# EAGLE board haasoscope_pro_adc_board - no blind (EAGLE 9.6.2), part 1 of 2
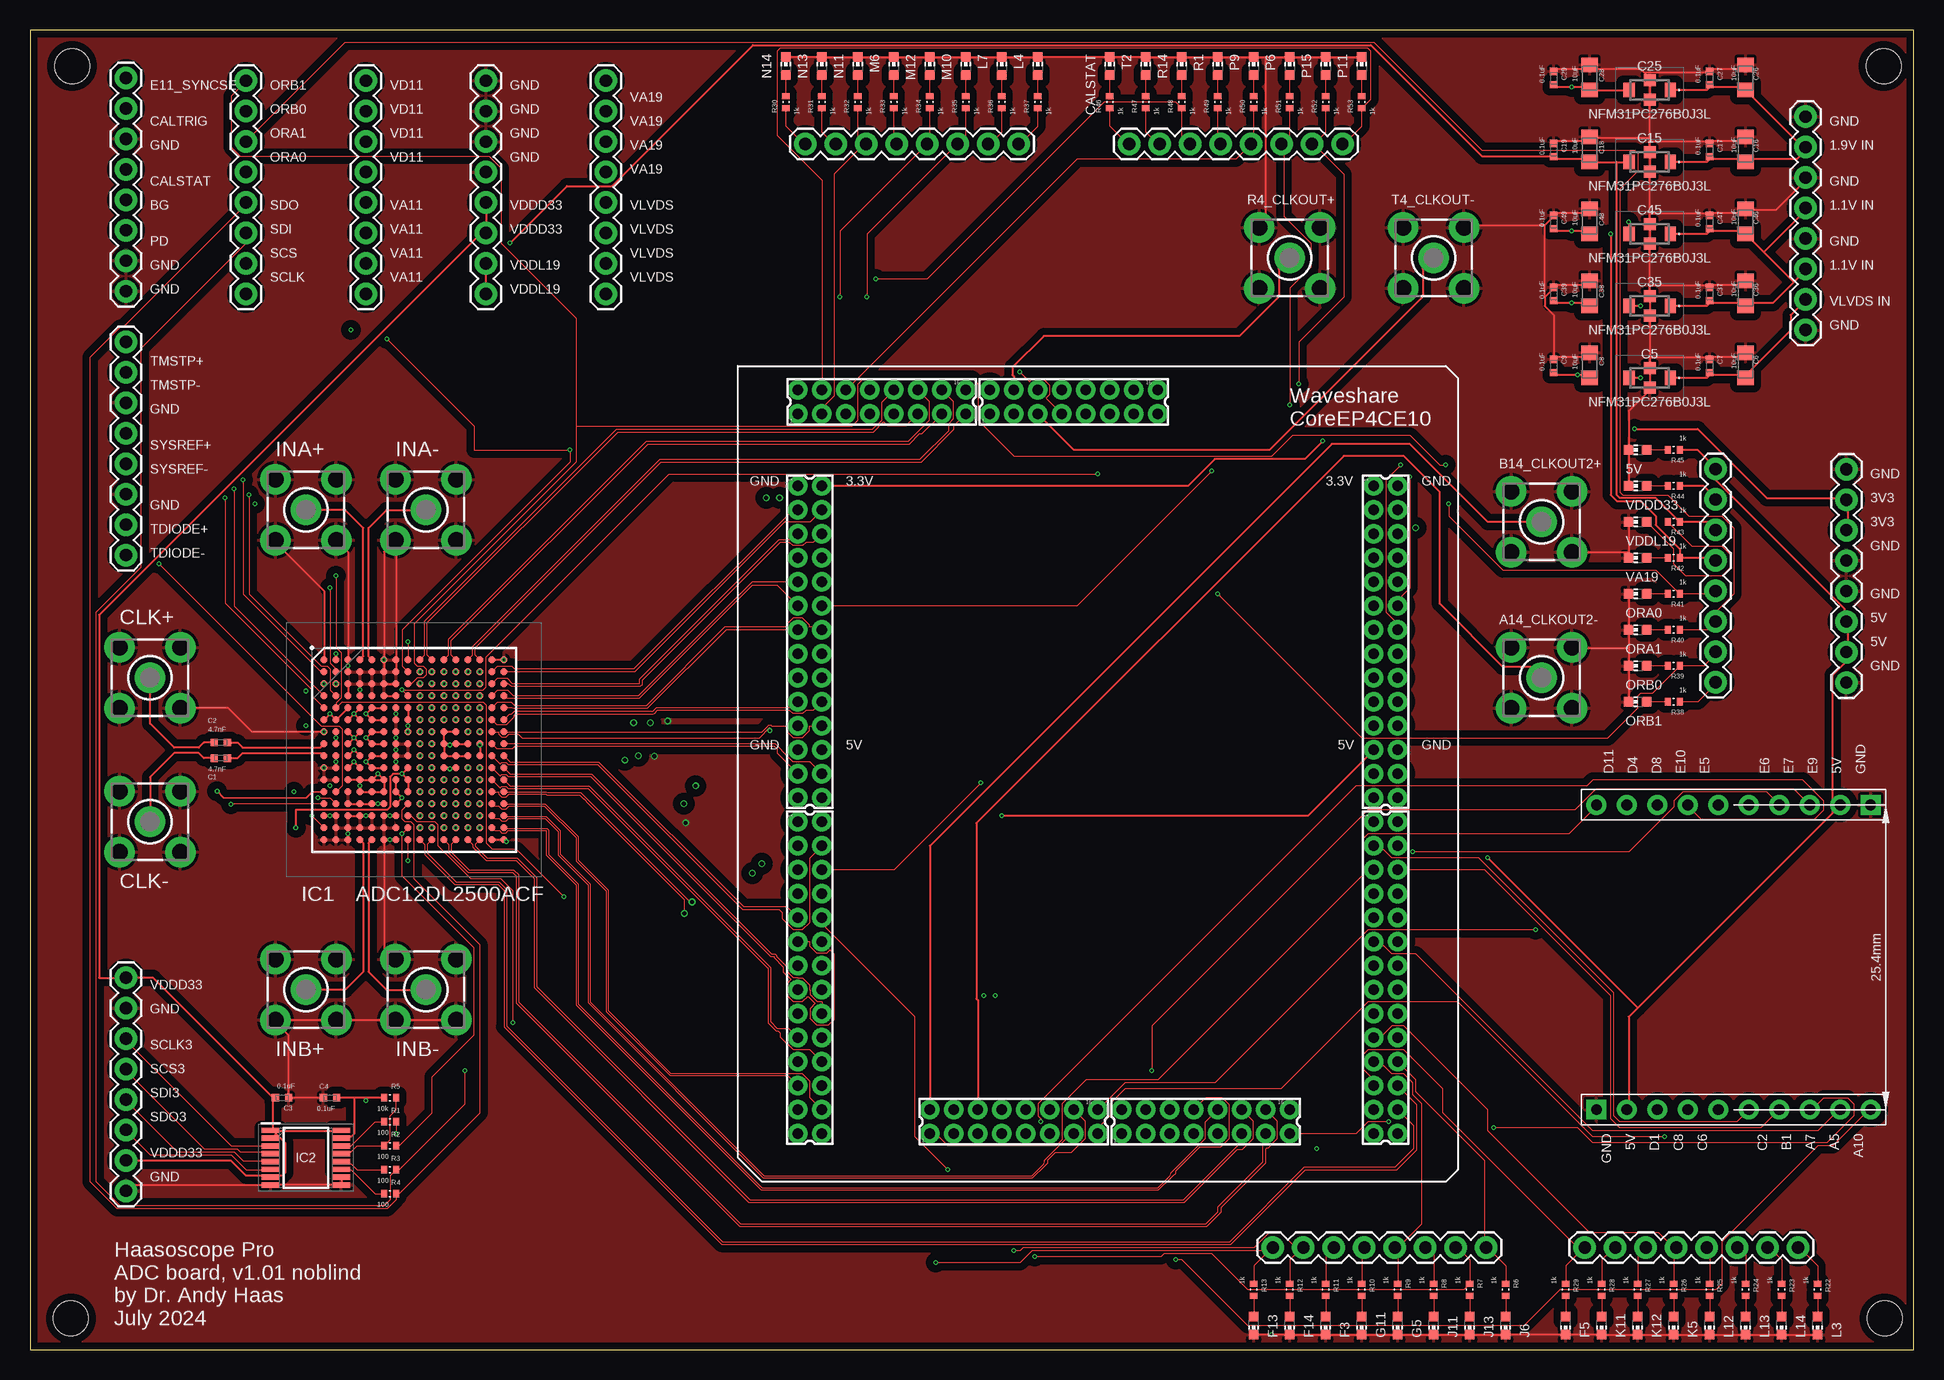
[diagram p3: board, top side]
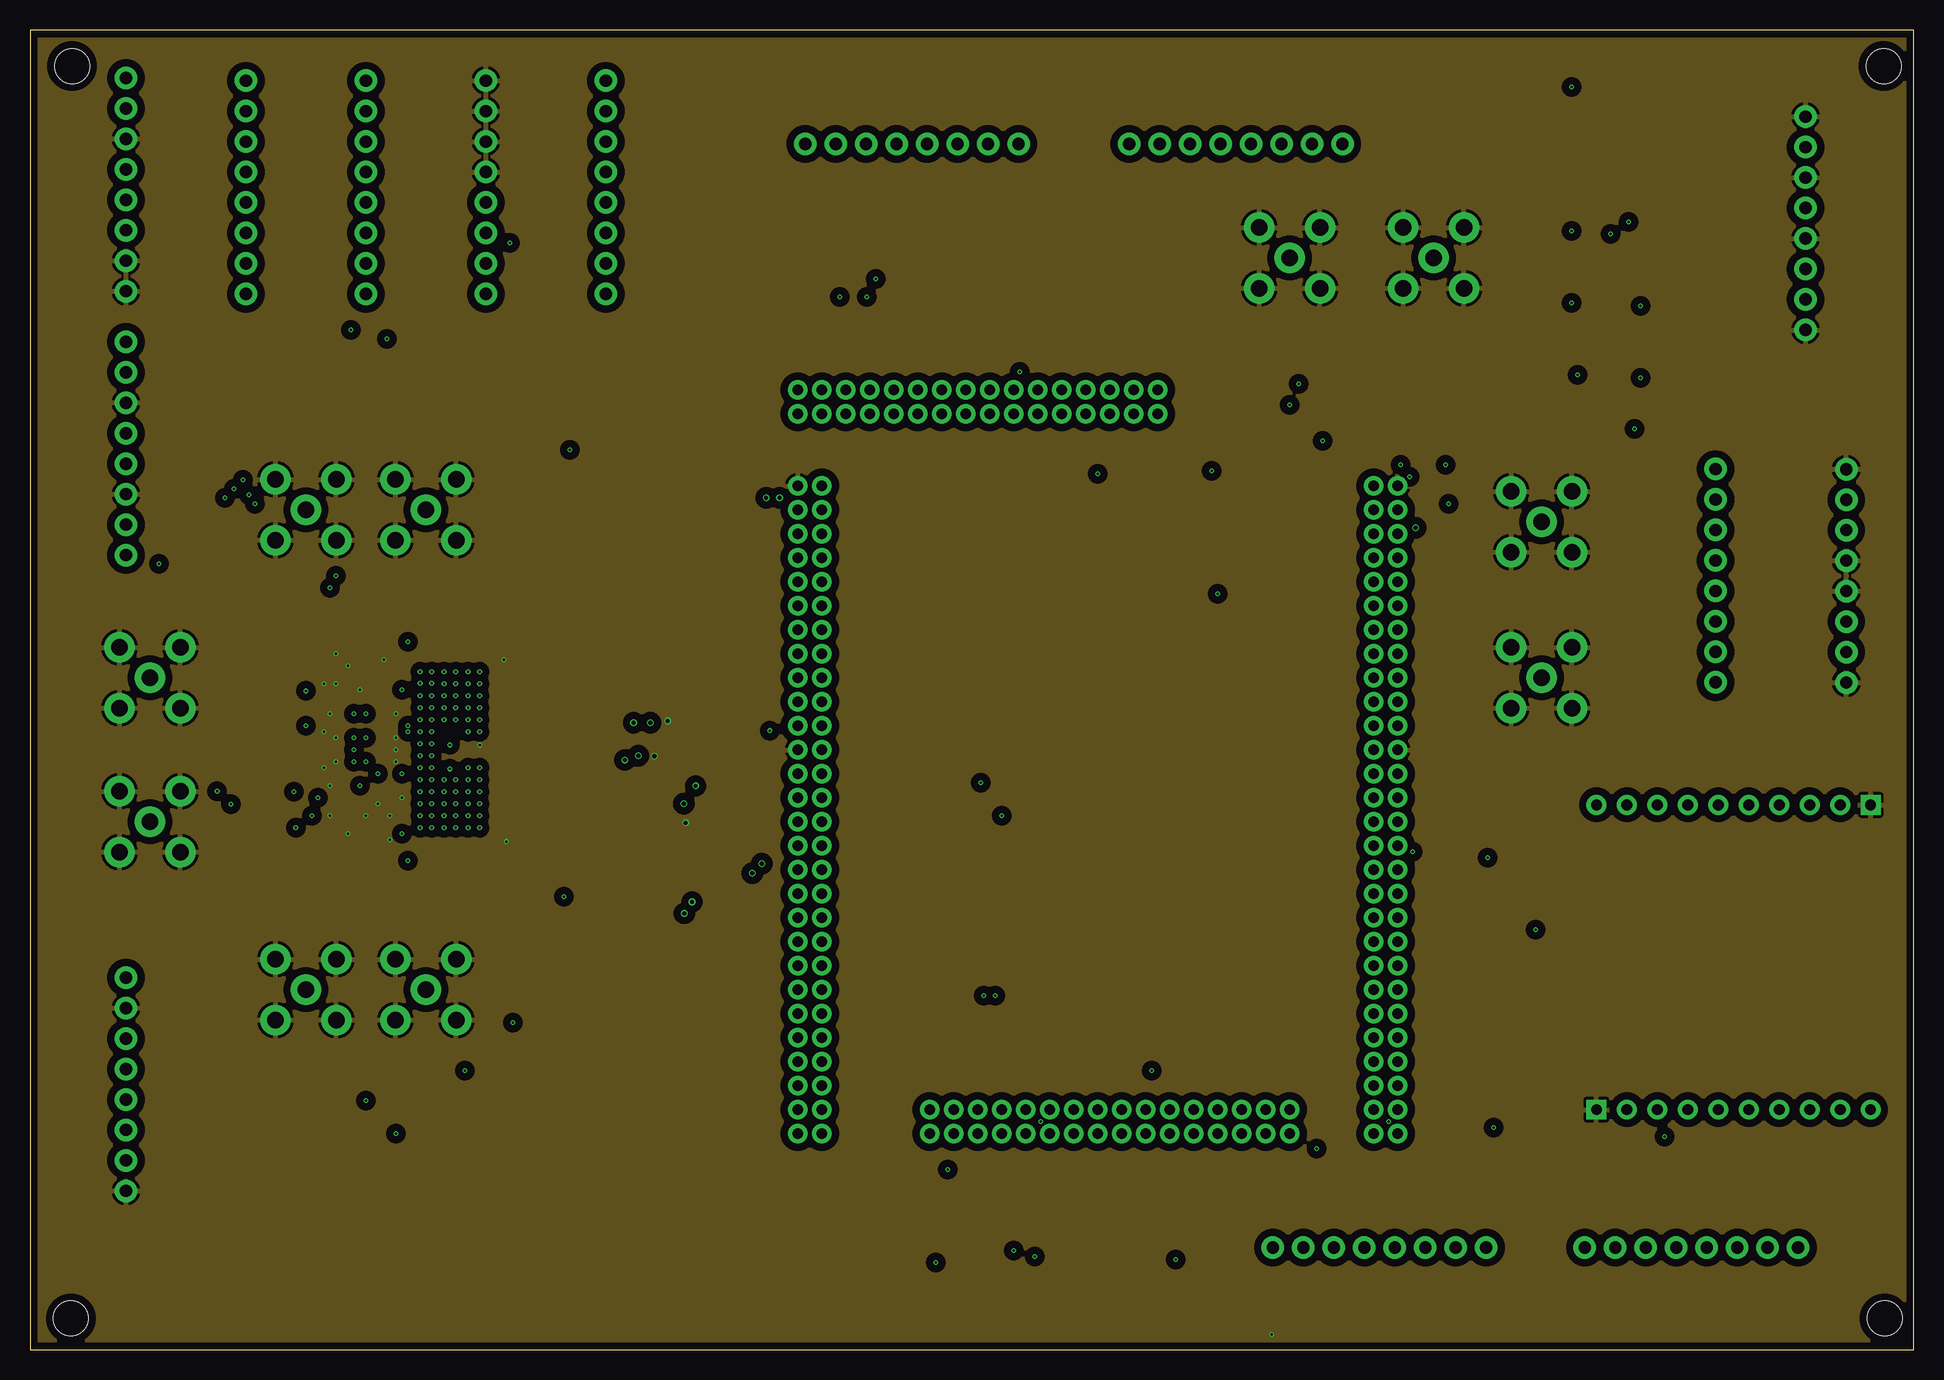
[diagram p4: board, inner layer topgnd]
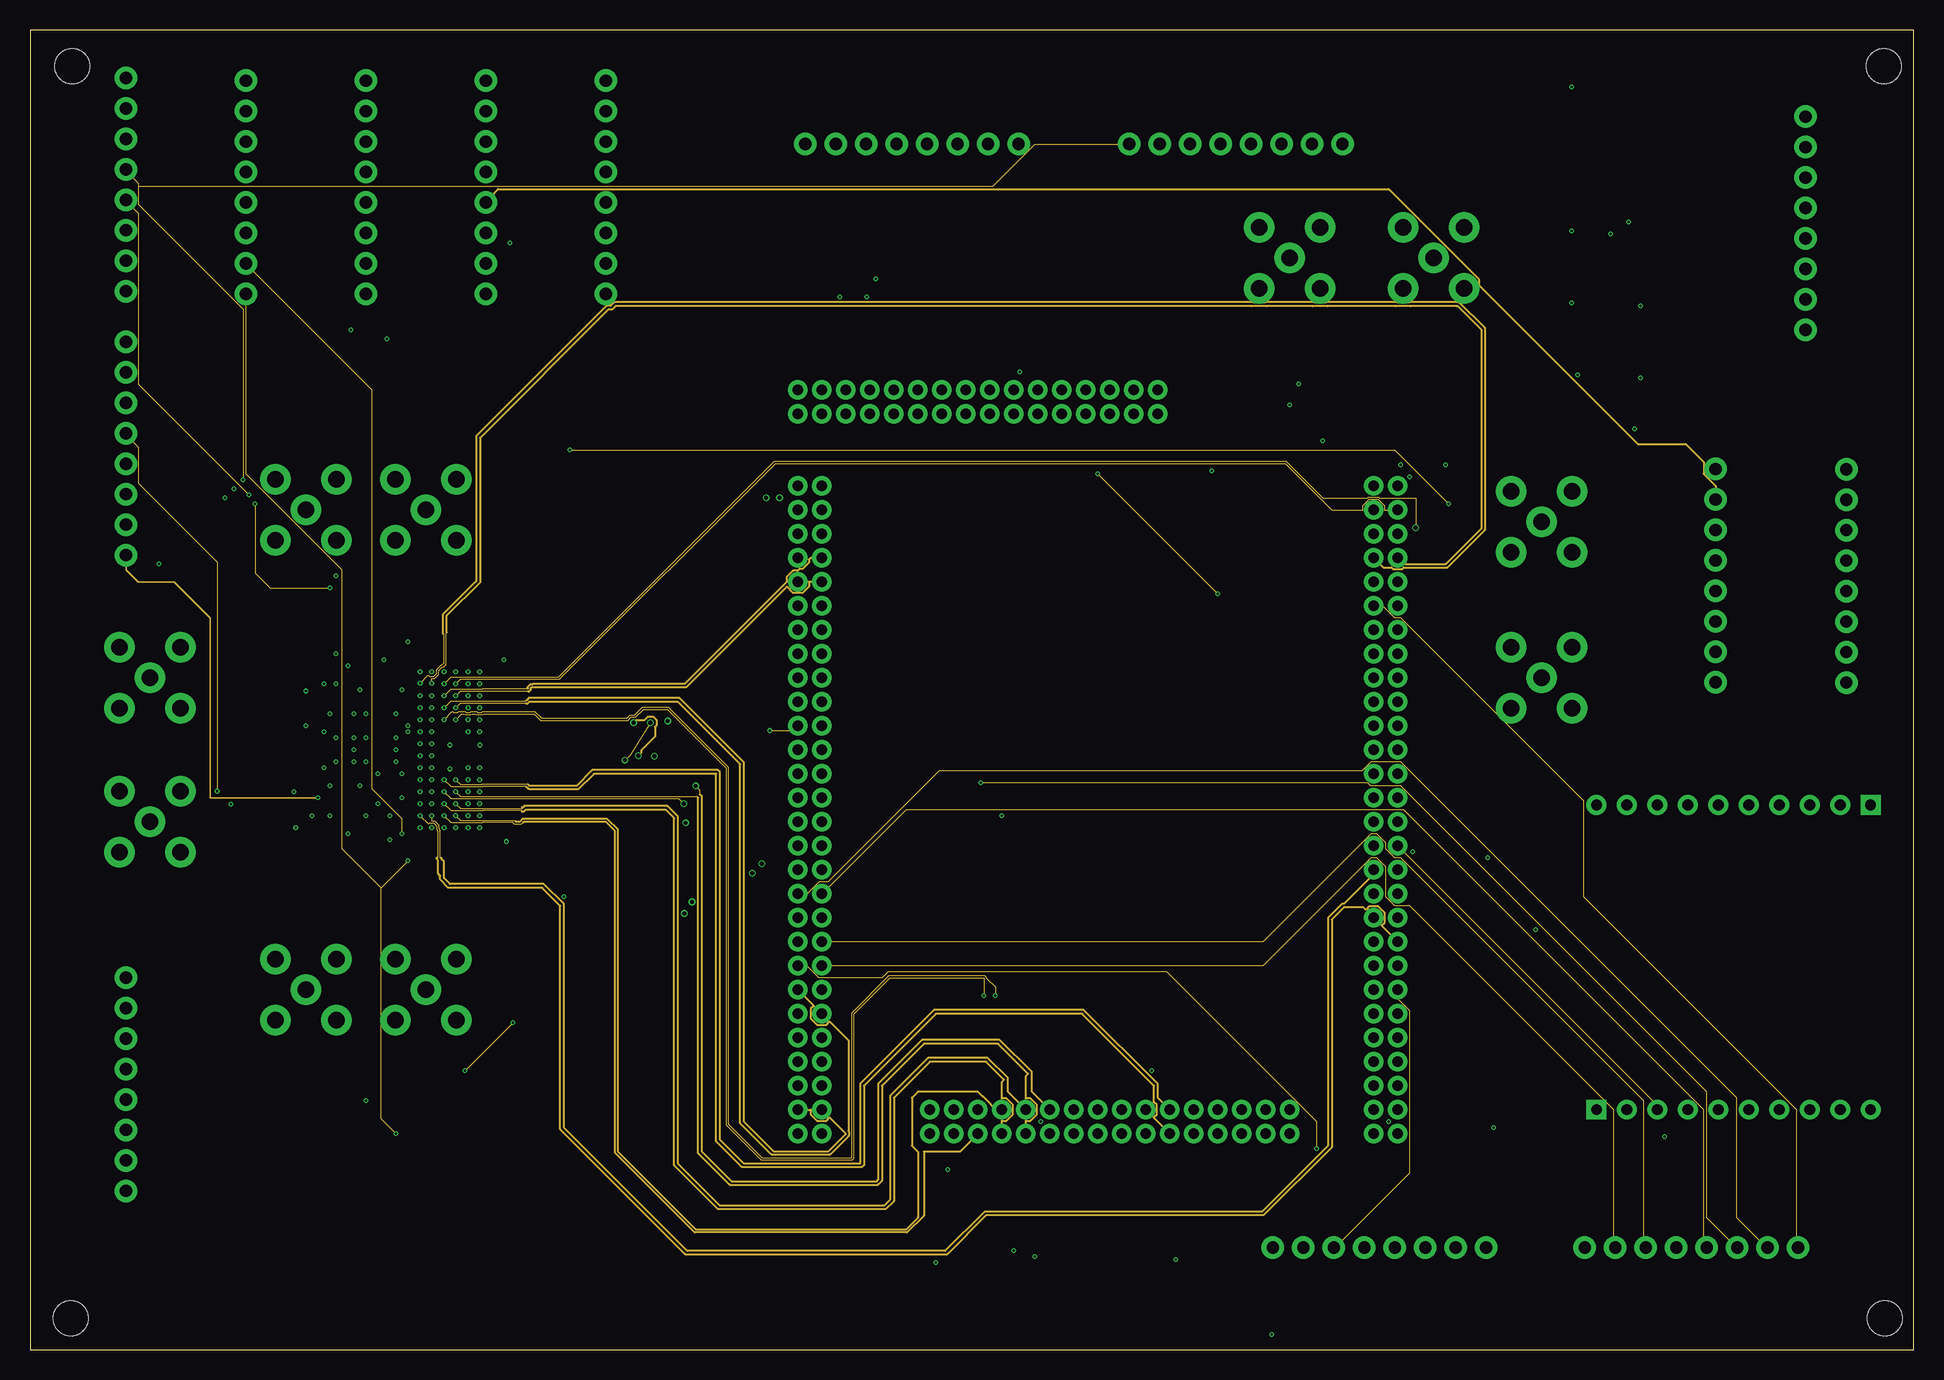
[diagram p5: board, inner layer sig2]
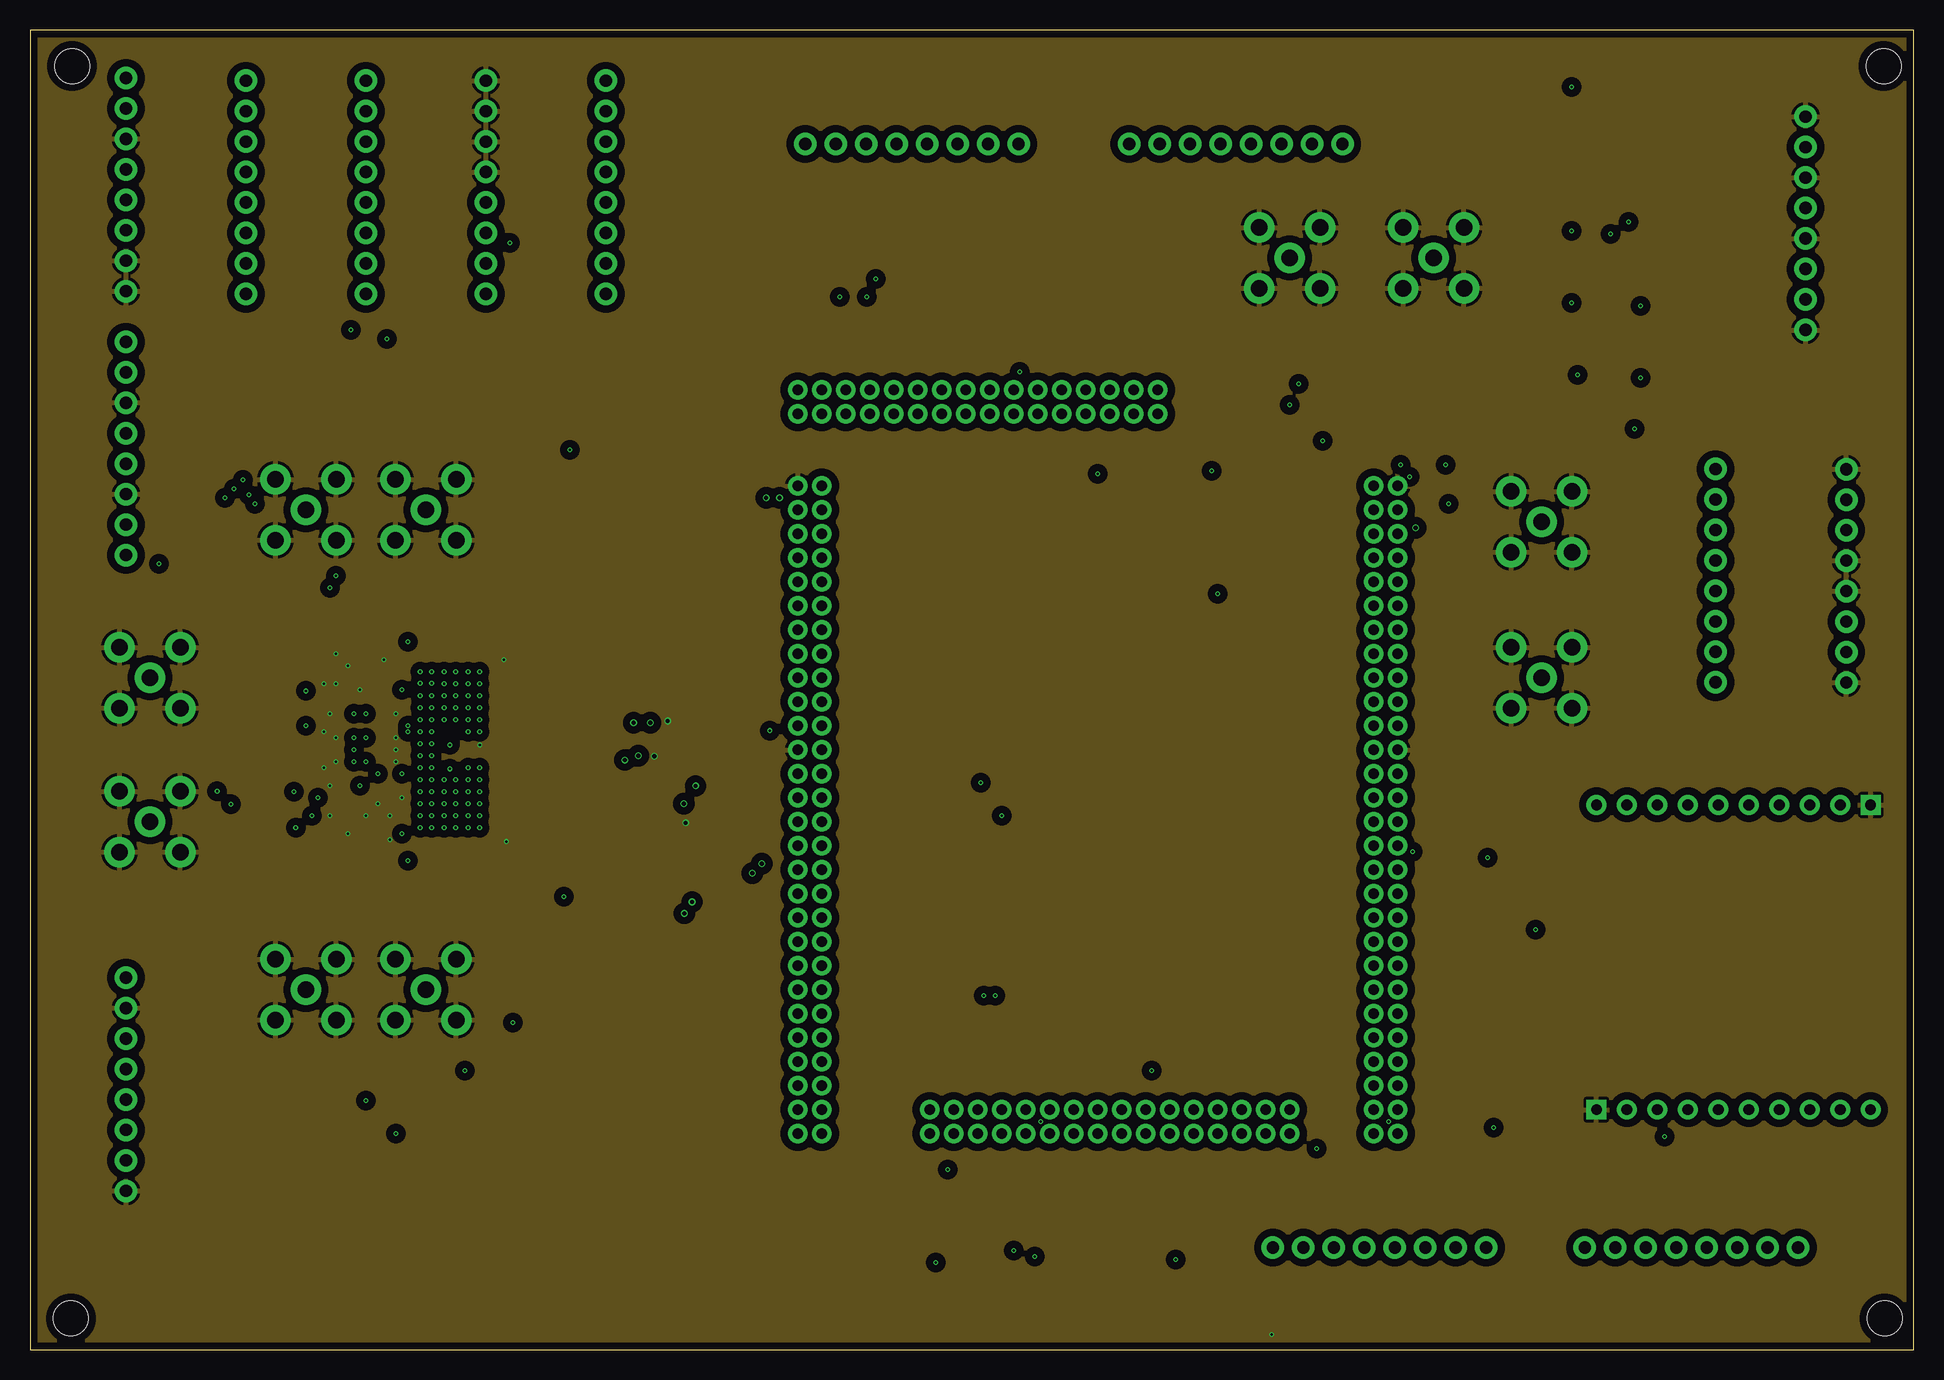
[diagram p6: board, inner layer sig2gnd]
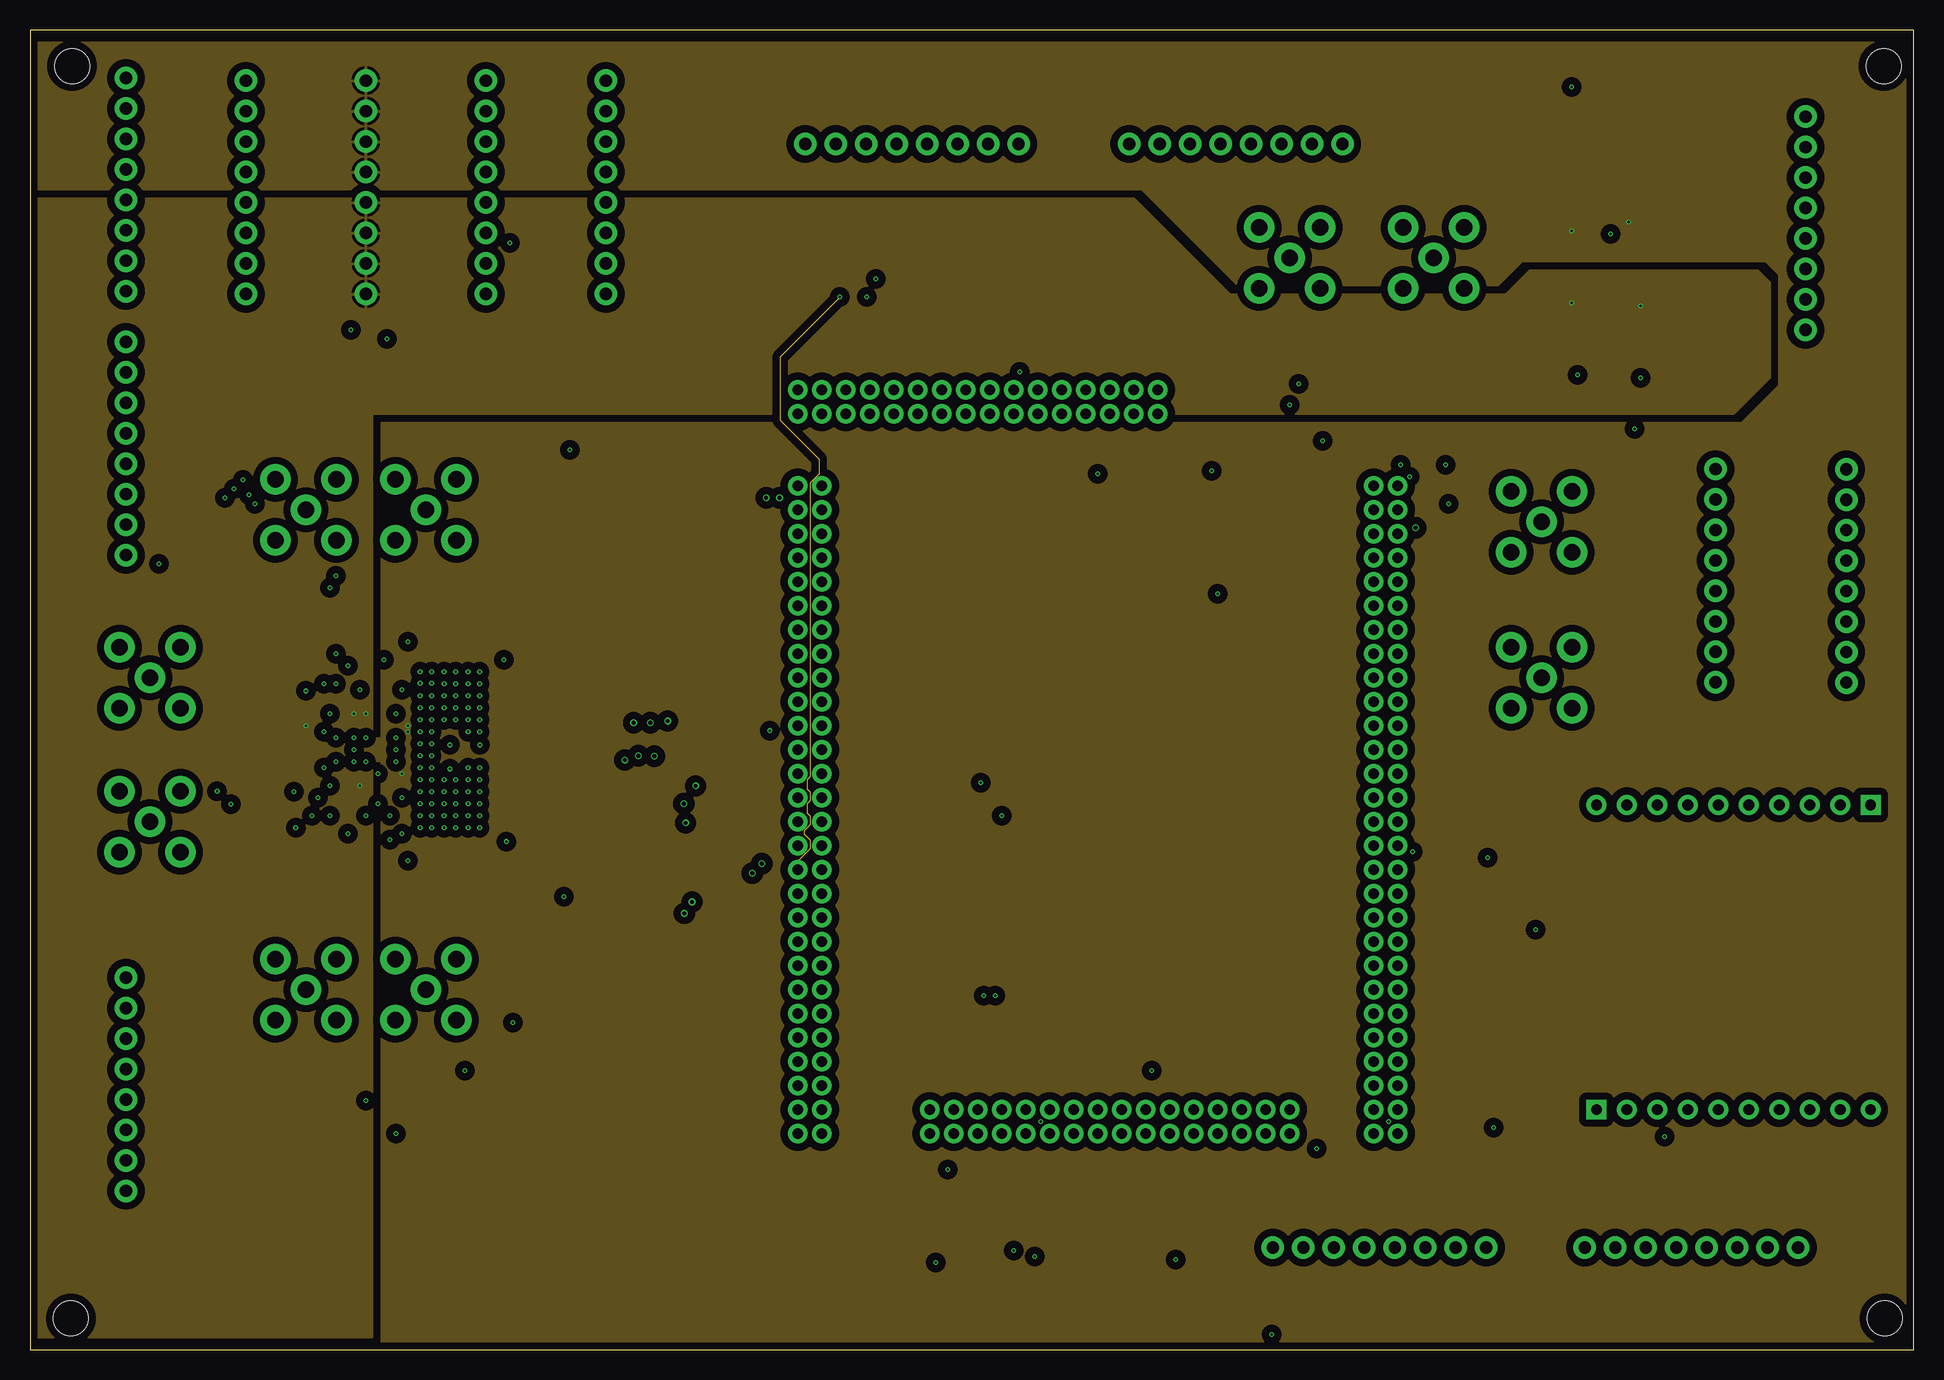
[diagram p7: board, inner layer pow1]
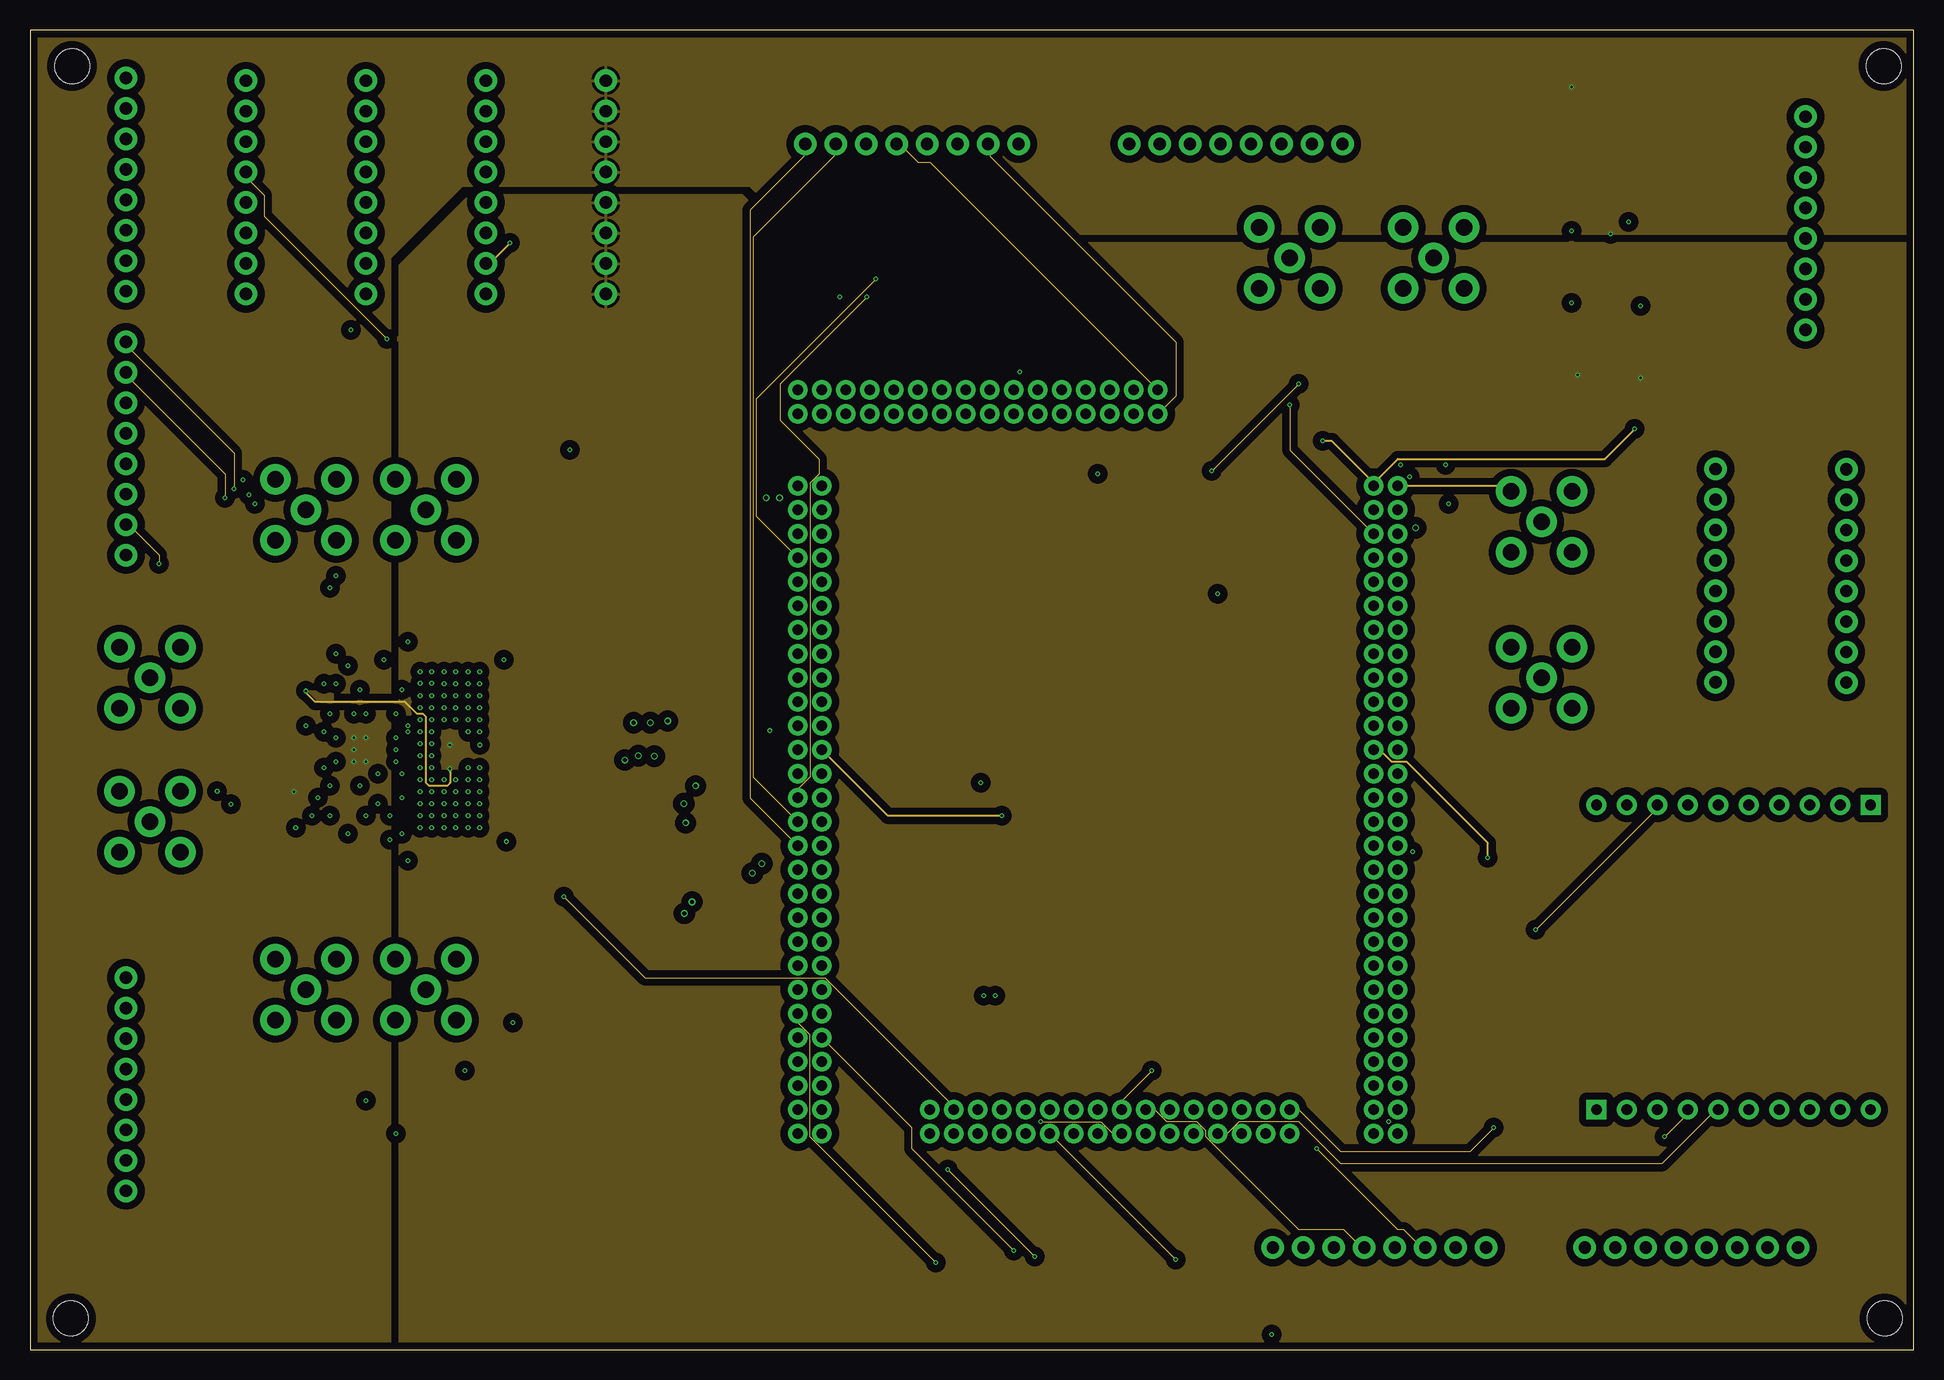
[diagram p8: board, inner layer pow2]
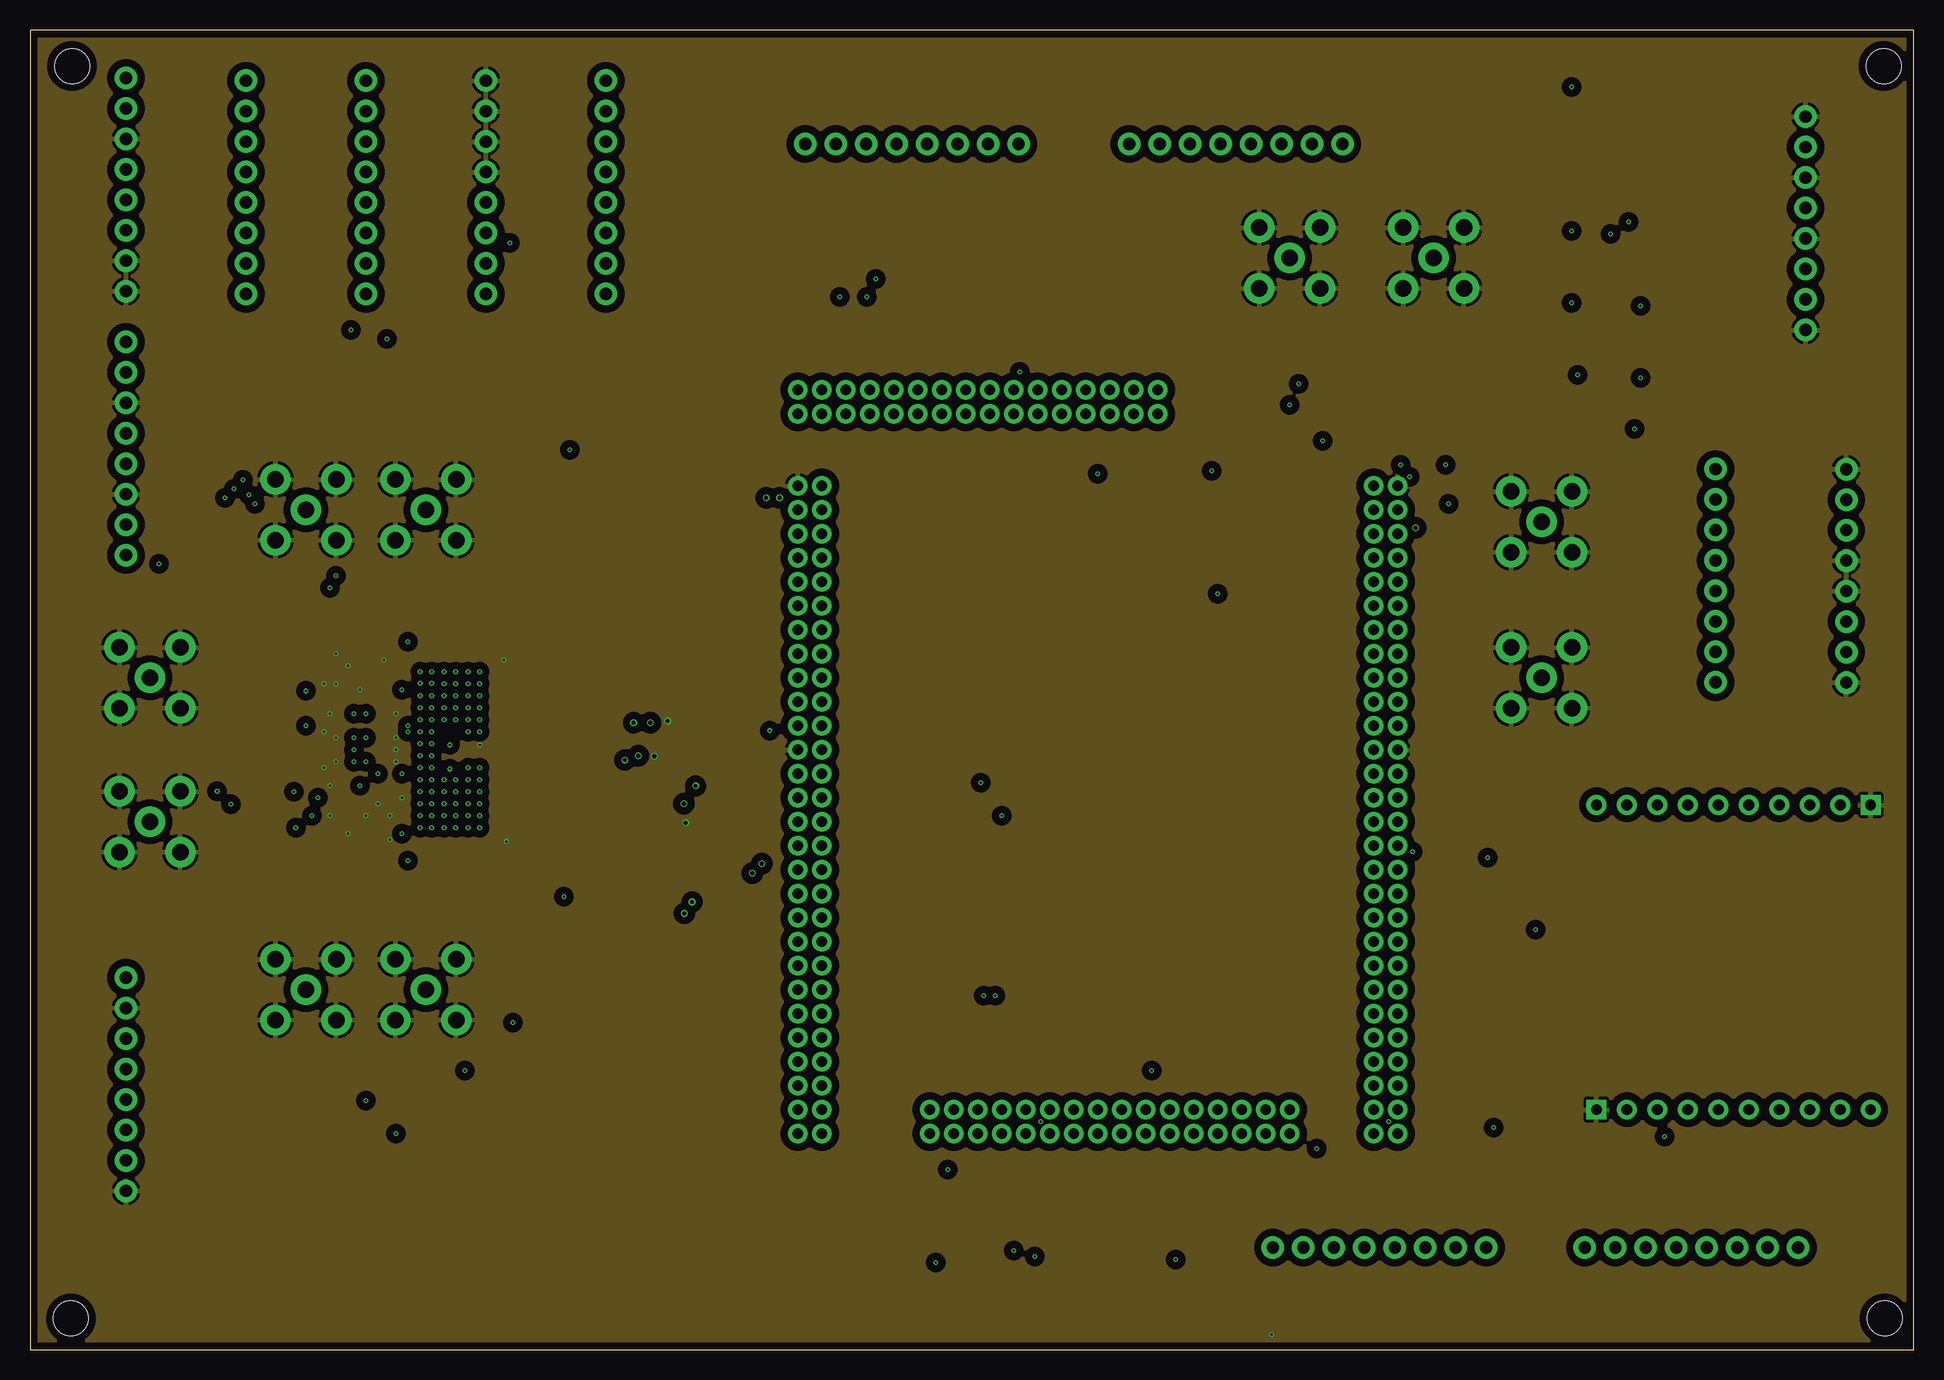
[diagram p9: board, inner layer sig4gnd]
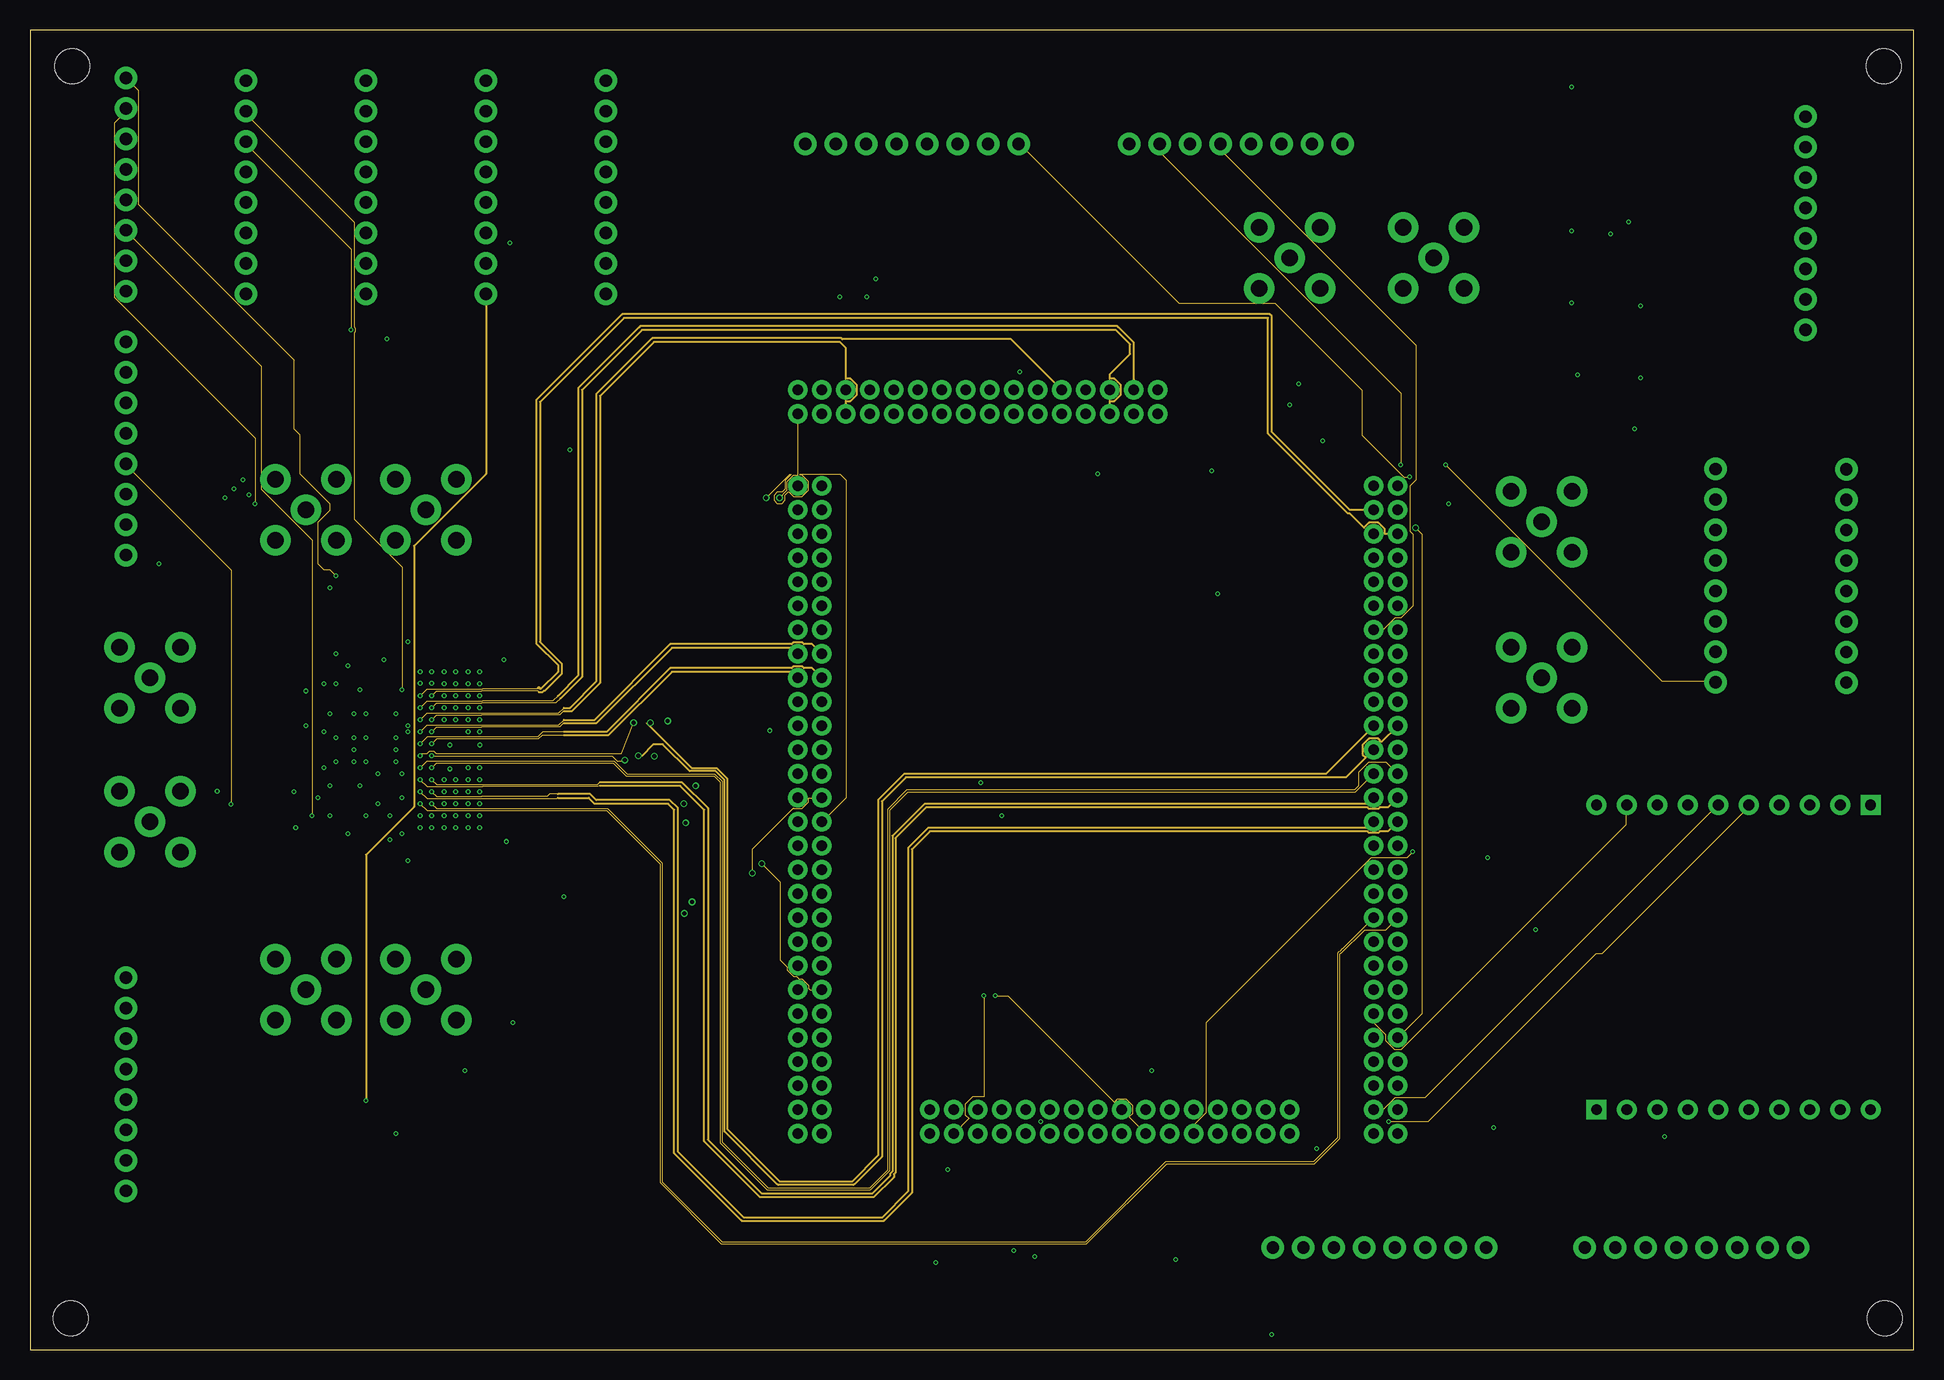
[diagram p10: board, inner layer sig4]
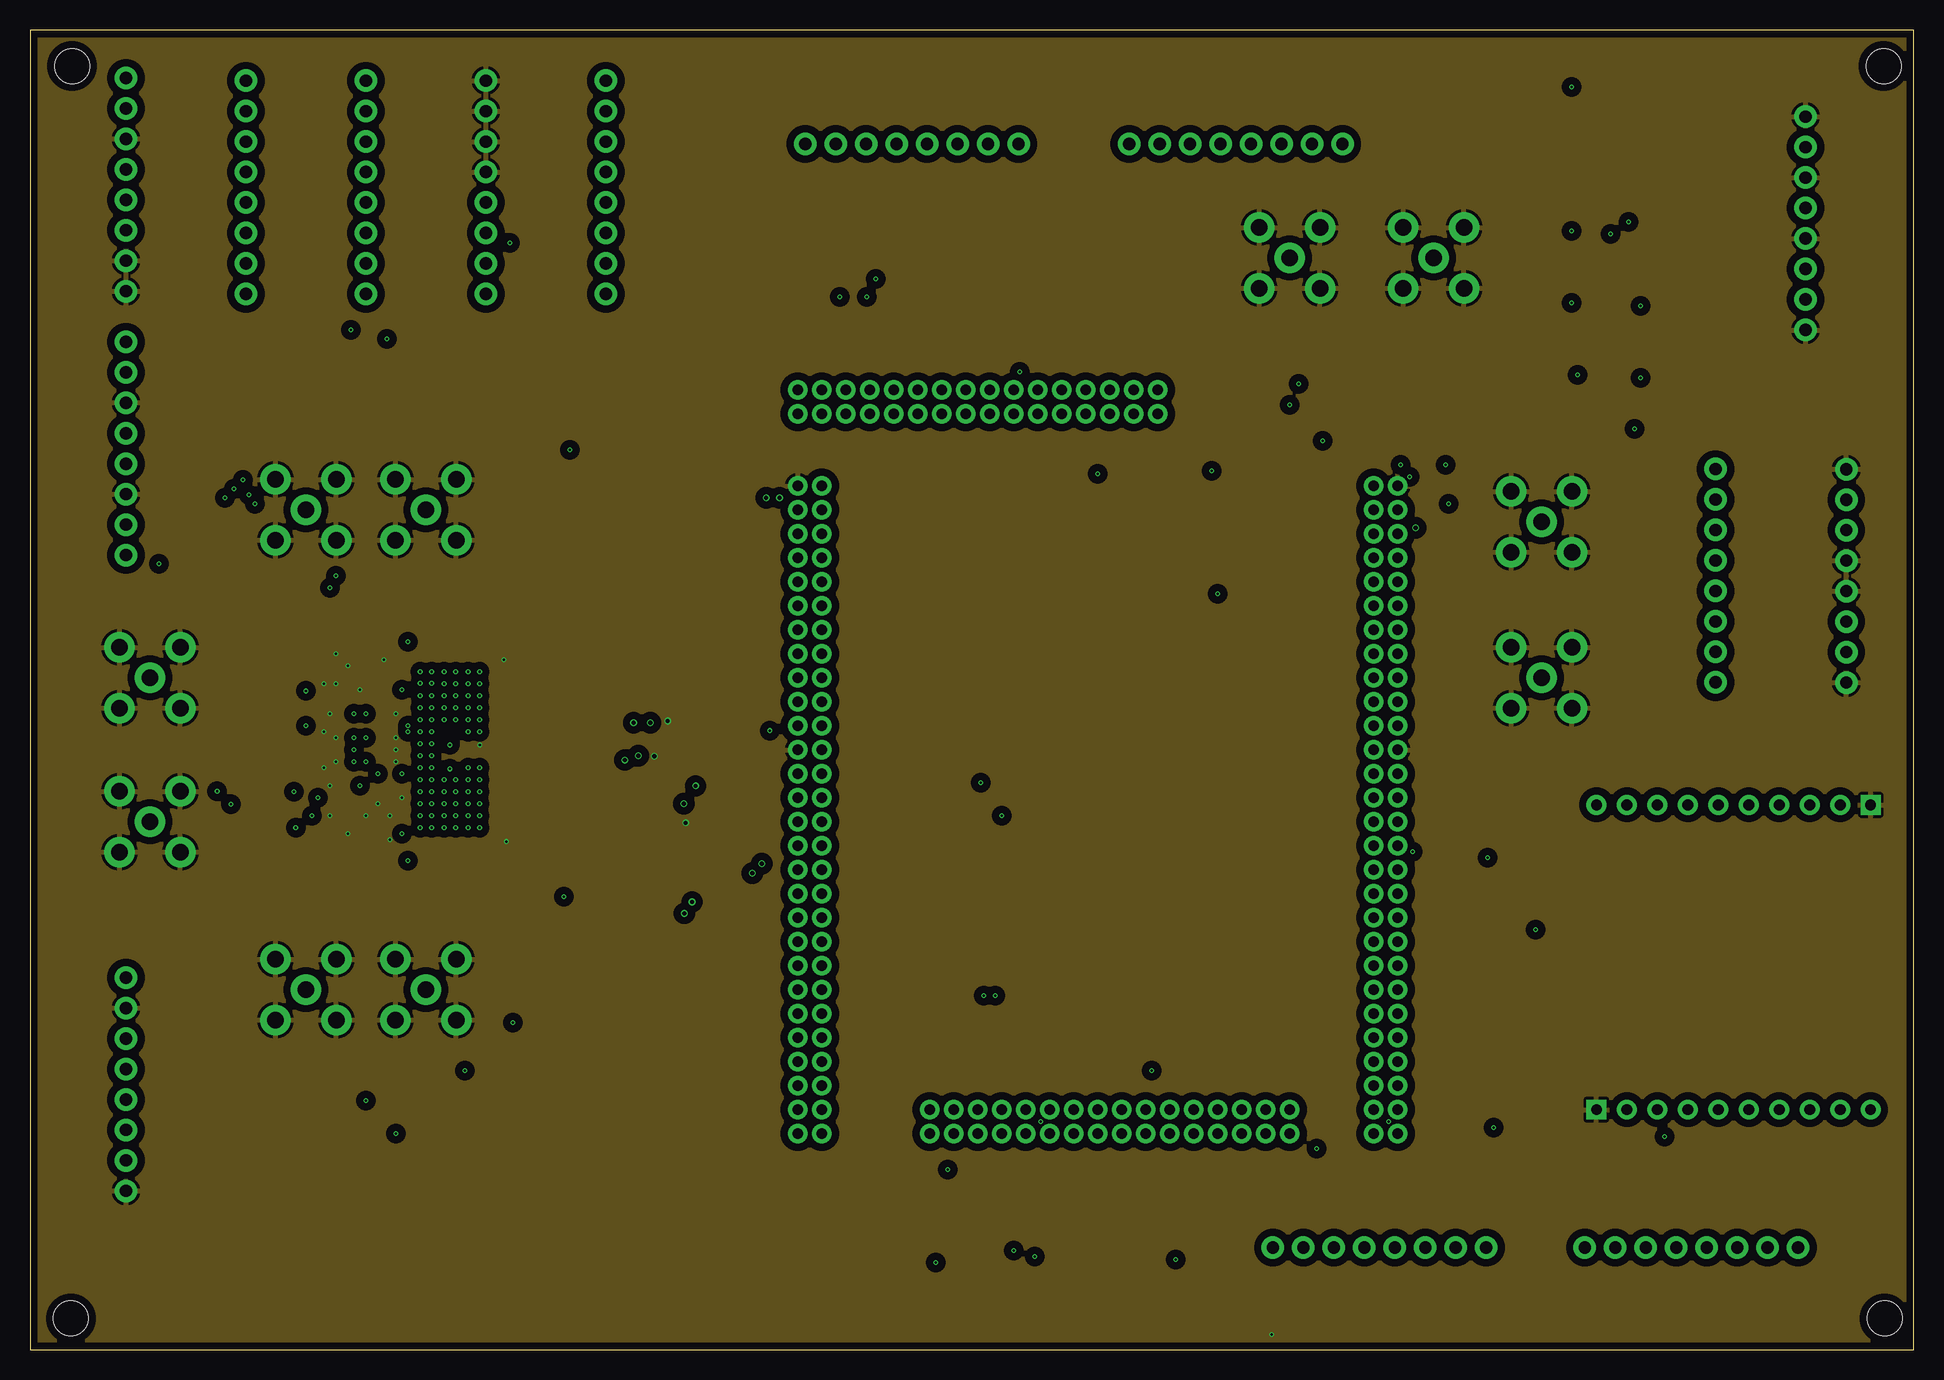
[diagram p11: board, inner layer sig5gnd]
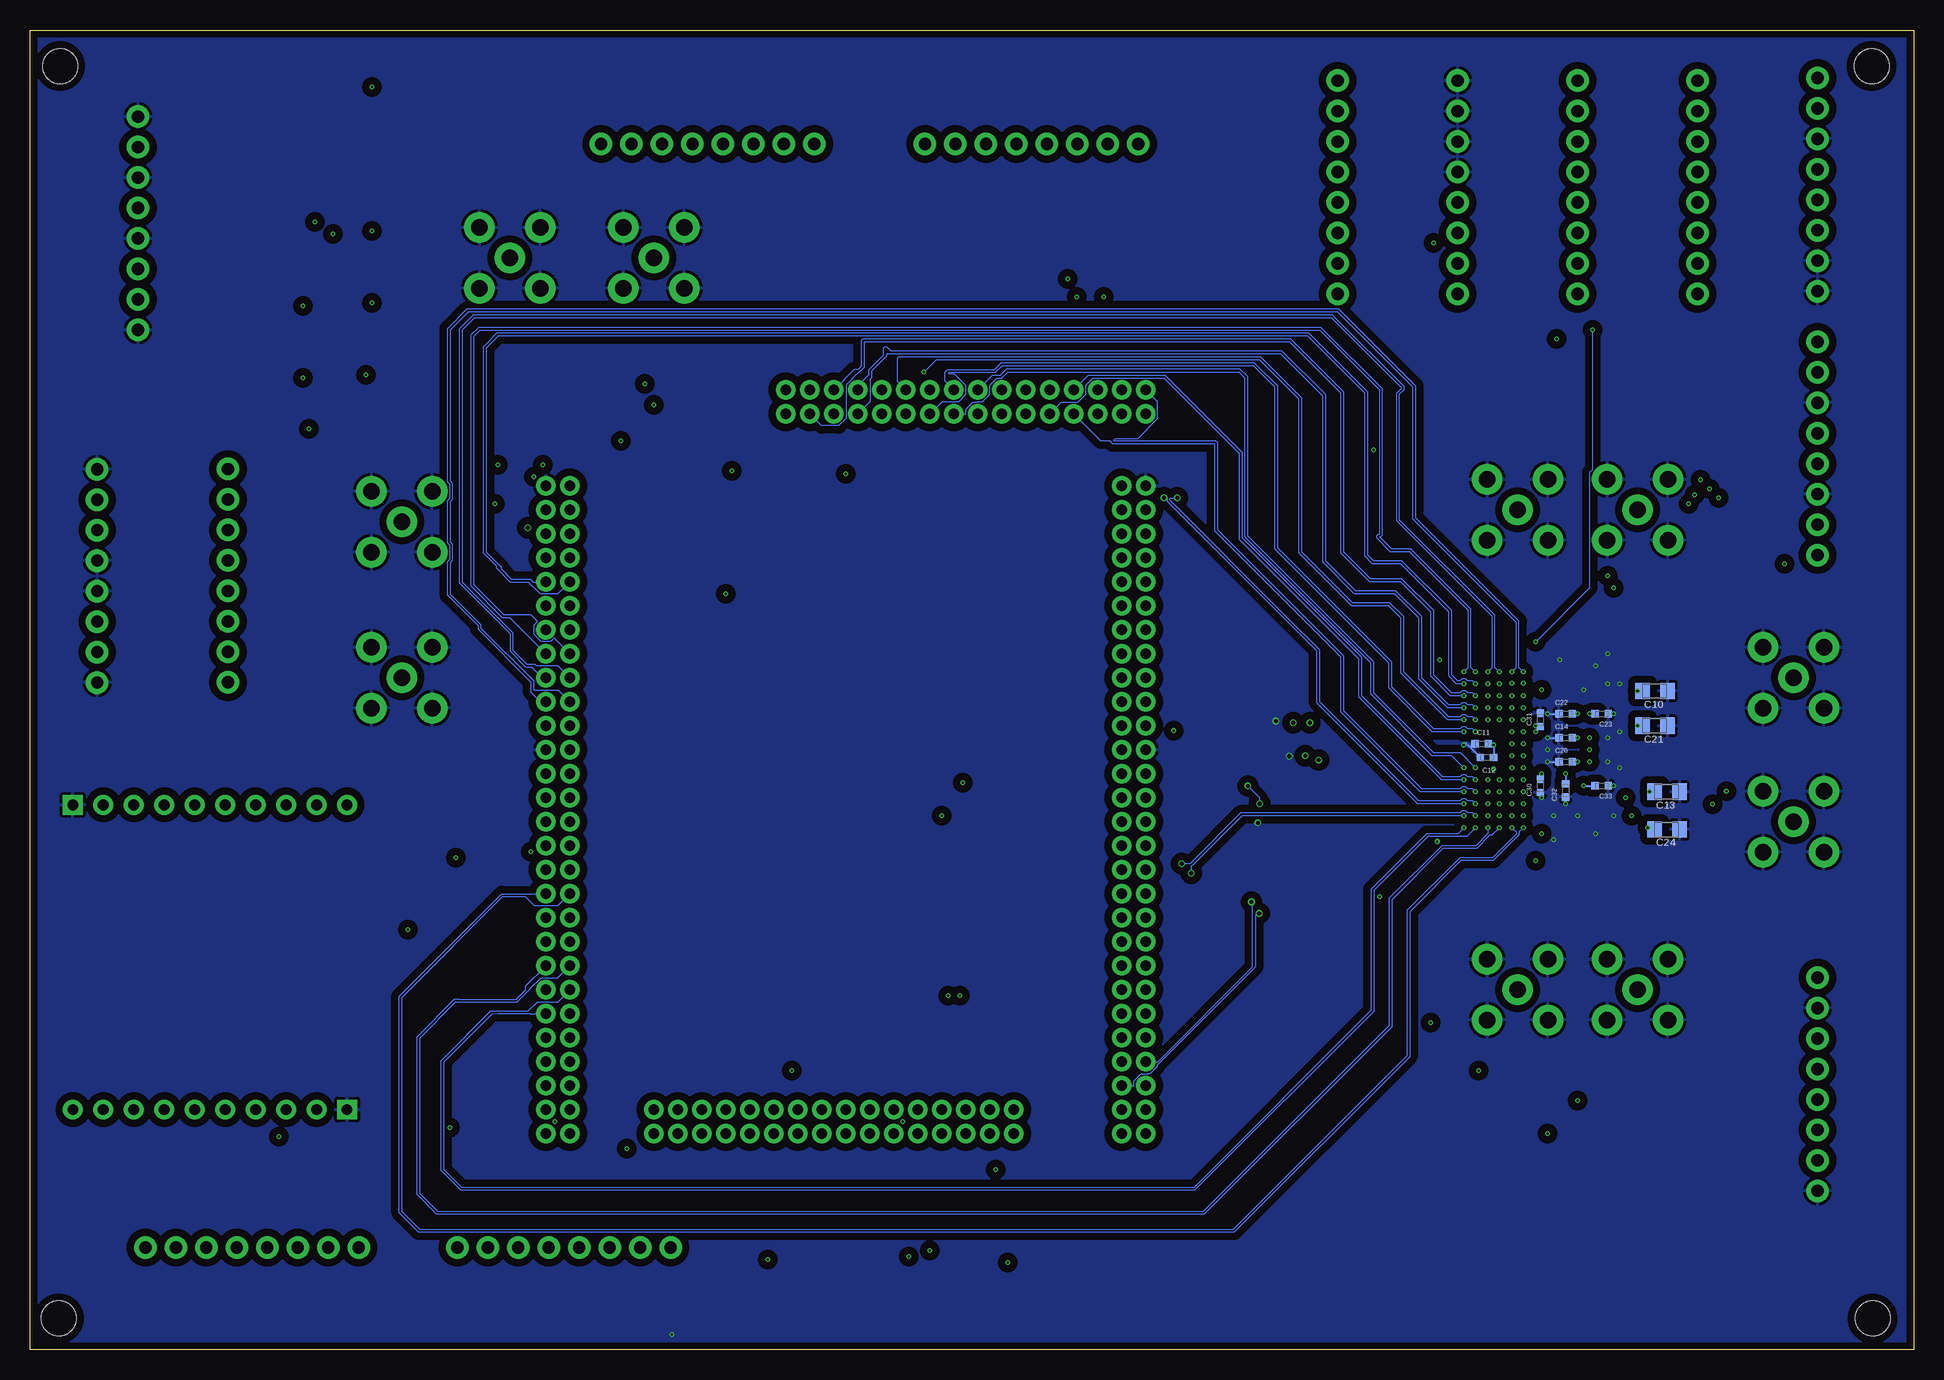
[diagram p12: board, bottom side, seen from below]

Size 157 x 110 mm. Coordinates in mm from the lower left corner, seen from the top.
Outline: 0,110 0,0 157,0 157,110 0,110
Copper layers (1+2*3+4*5+12*13+14*15+16): top 0.035mm / dielectric 0.2mm / topgnd 0.0175mm / dielectric 0.15mm / sig2 0.035mm / dielectric 0.2mm / sig2gnd 0.035mm / dielectric 0.15mm / pow1 0.035mm / dielectric 0.2mm / pow2 0.035mm / dielectric 0.15mm / sig4gnd 0.035mm / dielectric 0.2mm / sig4 0.035mm / dielectric 0.15mm / sig5gnd 0.0175mm / dielectric 0.2mm / sig5 0.035mm
Design rules "jlcpcb-10layers-haas": minimum track width 3.5mil, minimum drill 0.2mm, track to track 3.5mil, track to pad 5mil, pad to pad 5mil, via to via 0.5mm, smd to smd 5mil, copper to edge 0.2mm, drill to drill 6mil, minimum pad ring 10mil, minimum via ring 0.1mm, stop-mask expansion 0.05mm, vias tented up to drill 16mil, thermal gap 10mil
Net classes: 0 default: width 0.089 mm; 1 power: width 0.152 mm; 2 diffpair: width 0.089 mm; 3 loosediffpair: width 0.152 mm, clearance 0.305 mm to class 0, clearance 0.305 mm to class 1, clearance 0.305 mm to class 2, clearance 0.305 mm
Holes 2.9 mm at 3.4,2.6 154.6,2.6 3.5,107 154.5,107

## Footprints (pad centres in the part's own frame; a part is rotated, then mirrored left to right if it is on the bottom)
BU-SMB-V = drill 1.4: 1 0,0; 2 -2.54,2.54; 3 2.54,2.54; 4 2.54,-2.54; 5 -2.54,-2.54
RESC0402_N = smd 0.6 x 0.6: 1 -0.55,0; 2 0.55,0
NFM31HK103R1H3L = smd 0.95 x 1.2: 1 -1.725,0; 3 1.725,0 | smd 1 x 1: 2 0,-0.8; 4 0,0.8
RESC0805_N = smd 1.2 x 1.35: 1 -1.1,0; 2 1,0
BGA256C100P16X16_1700X1700X331 = smd 0.53 x 0.53: A1 -7.5,7.5; A2 -6.5,7.5; A3 -5.5,7.5; A4 -4.5,7.5; A5 -3.5,7.5; A6 -2.5,7.5; A7 -1.5,7.5; A8 -0.5,7.5; A9 0.5,7.5; A10 1.5,7.5; A11 2.5,7.5; A12 3.5,7.5; A13 4.5,7.5; A14 5.5,7.5; A15 6.5,7.5; A16 7.5,7.5; B1 -7.5,6.5; B2 -6.5,6.5; B3 -5.5,6.5; B4 -4.5,6.5; B5 -3.5,6.5; B6 -2.5,6.5; B7 -1.5,6.5; B8 -0.5,6.5; B9 0.5,6.5; B10 1.5,6.5; B11 2.5,6.5; B12 3.5,6.5; B13 4.5,6.5; B14 5.5,6.5; B15 6.5,6.5; B16 7.5,6.5; C1 -7.5,5.5; C2 -6.5,5.5; C3 -5.5,5.5; C4 -4.5,5.5; C5 -3.5,5.5; C6 -2.5,5.5; C7 -1.5,5.5; C8 -0.5,5.5; C9 0.5,5.5; C10 1.5,5.5; C11 2.5,5.5; C12 3.5,5.5; C13 4.5,5.5; C14 5.5,5.5; C15 6.5,5.5; C16 7.5,5.5; D1 -7.5,4.5; D2 -6.5,4.5; D3 -5.5,4.5; D4 -4.5,4.5; D5 -3.5,4.5; D6 -2.5,4.5; D7 -1.5,4.5; D8 -0.5,4.5; D9 0.5,4.5; D10 1.5,4.5; D11 2.5,4.5; D12 3.5,4.5; D13 4.5,4.5; D14 5.5,4.5; D15 6.5,4.5; D16 7.5,4.5; E1 -7.5,3.5; E2 -6.5,3.5; E3 -5.5,3.5; E4 -4.5,3.5; E5 -3.5,3.5; E6 -2.5,3.5; E7 -1.5,3.5; E8 -0.5,3.5; E9 0.5,3.5; E10 1.5,3.5; E11 2.5,3.5; E12 3.5,3.5; E13 4.5,3.5; E14 5.5,3.5; E15 6.5,3.5; E16 7.5,3.5; F1 -7.5,2.5; F2 -6.5,2.5; F3 -5.5,2.5; F4 -4.5,2.5; F5 -3.5,2.5; F6 -2.5,2.5; F7 -1.5,2.5; F8 -0.5,2.5; F9 0.5,2.5; F10 1.5,2.5; F11 2.5,2.5; F12 3.5,2.5; F13 4.5,2.5; F14 5.5,2.5; F15 6.5,2.5; F16 7.5,2.5; G1 -7.5,1.5; G2 -6.5,1.5; G3 -5.5,1.5; G4 -4.5,1.5; G5 -3.5,1.5; G6 -2.5,1.5; G7 -1.5,1.5; G8 -0.5,1.5; G9 0.5,1.5; G10 1.5,1.5; G11 2.5,1.5; G12 3.5,1.5; G13 4.5,1.5; G14 5.5,1.5; G15 6.5,1.5; G16 7.5,1.5; H1 -7.5,0.5; H2 -6.5,0.5; H3 -5.5,0.5; H4 -4.5,0.5; H5 -3.5,0.5; H6 -2.5,0.5; H7 -1.5,0.5; H8 -0.5,0.5; H9 0.5,0.5; H10 1.5,0.5; H11 2.5,0.5; H12 3.5,0.5; H13 4.5,0.5; H14 5.5,0.5; H15 6.5,0.5; H16 7.5,0.5; J1 -7.5,-0.5; J2 -6.5,-0.5; J3 -5.5,-0.5; J4 -4.5,-0.5; J5 -3.5,-0.5; J6 -2.5,-0.5; J7 -1.5,-0.5; J8 -0.5,-0.5; J9 0.5,-0.5; J10 1.5,-0.5; J11 2.5,-0.5; J12 3.5,-0.5; J13 4.5,-0.5; J14 5.5,-0.5; J15 6.5,-0.5; J16 7.5,-0.5; K1 -7.5,-1.5; K2 -6.5,-1.5; K3 -5.5,-1.5; K4 -4.5,-1.5; K5 -3.5,-1.5; K6 -2.5,-1.5; K7 -1.5,-1.5; K8 -0.5,-1.5; K9 0.5,-1.5; K10 1.5,-1.5; K11 2.5,-1.5; K12 3.5,-1.5; K13 4.5,-1.5; K14 5.5,-1.5; K15 6.5,-1.5; K16 7.5,-1.5; L1 -7.5,-2.5; L2 -6.5,-2.5; L3 -5.5,-2.5; L4 -4.5,-2.5; L5 -3.5,-2.5; L6 -2.5,-2.5; L7 -1.5,-2.5; L8 -0.5,-2.5; L9 0.5,-2.5; L10 1.5,-2.5; L11 2.5,-2.5; L12 3.5,-2.5; L13 4.5,-2.5; L14 5.5,-2.5; L15 6.5,-2.5; L16 7.5,-2.5; M1 -7.5,-3.5; M2 -6.5,-3.5; M3 -5.5,-3.5; M4 -4.5,-3.5; M5 -3.5,-3.5; M6 -2.5,-3.5; M7 -1.5,-3.5; M8 -0.5,-3.5; M9 0.5,-3.5; M10 1.5,-3.5; M11 2.5,-3.5; M12 3.5,-3.5; M13 4.5,-3.5; M14 5.5,-3.5; M15 6.5,-3.5; M16 7.5,-3.5; N1 -7.5,-4.5; N2 -6.5,-4.5; N3 -5.5,-4.5; N4 -4.5,-4.5; N5 -3.5,-4.5; N6 -2.5,-4.5; N7 -1.5,-4.5; N8 -0.5,-4.5; N9 0.5,-4.5; N10 1.5,-4.5; N11 2.5,-4.5; N12 3.5,-4.5; N13 4.5,-4.5; N14 5.5,-4.5; N15 6.5,-4.5; N16 7.5,-4.5; P1 -7.5,-5.5; P2 -6.5,-5.5; P3 -5.5,-5.5; P4 -4.5,-5.5; P5 -3.5,-5.5; P6 -2.5,-5.5; P7 -1.5,-5.5; P8 -0.5,-5.5; P9 0.5,-5.5; P10 1.5,-5.5; P11 2.5,-5.5; P12 3.5,-5.5; P13 4.5,-5.5; P14 5.5,-5.5; P15 6.5,-5.5; P16 7.5,-5.5; R1 -7.5,-6.5; R2 -6.5,-6.5; R3 -5.5,-6.5; R4 -4.5,-6.5; R5 -3.5,-6.5; R6 -2.5,-6.5; R7 -1.5,-6.5; R8 -0.5,-6.5; R9 0.5,-6.5; R10 1.5,-6.5; R11 2.5,-6.5; R12 3.5,-6.5; R13 4.5,-6.5; R14 5.5,-6.5; R15 6.5,-6.5; R16 7.5,-6.5; T1 -7.5,-7.5; T2 -6.5,-7.5; T3 -5.5,-7.5; T4 -4.5,-7.5; T5 -3.5,-7.5; T6 -2.5,-7.5; T7 -1.5,-7.5; T8 -0.5,-7.5; T9 0.5,-7.5; T10 1.5,-7.5; T11 2.5,-7.5; T12 3.5,-7.5; T13 4.5,-7.5; T14 5.5,-7.5; T15 6.5,-7.5; T16 7.5,-7.5
SOP65P640X120-16N = smd 1.475 x 0.45: 1 -2.938,2.275; 2 -2.938,1.625; 3 -2.938,0.975; 4 -2.938,0.325; 5 -2.938,-0.325; 6 -2.938,-0.975; 7 -2.938,-1.625; 8 -2.938,-2.275; 9 2.938,-2.275; 10 2.938,-1.625; 11 2.938,-0.975; 12 2.938,-0.325; 13 2.938,0.325; 14 2.938,0.975; 15 2.938,1.625; 16 2.938,2.275
1X08 = drill 1.016 pad 1.88: 1 0,0; 2 2.54,0; 3 5.08,0; 4 7.62,0; 5 10.16,0; 6 12.7,0; 7 15.24,0; 8 17.78,0
CHIP-LED0603 = smd 0.8 x 0.8: A 0,-0.75; C 0,0.75
H10-2.54 = drill 0.889 pad 1.651 square: 1 0,11.43 | drill 0.889 pad 1.651: 2 0,8.89; 3 0,6.35; 4 0,3.81; 5 0,1.27; 6 0,-1.27; 7 0,-3.81; 8 0,-6.35; 9 0,-8.89; 10 0,-11.43
RES-0402 = smd 0.5 x 0.6: P$1 -0.5,0; P$2 0.5,0
87758-1616 = drill 0.9 pad 1.27: 1 -7,-1; 2 -7,1; 3 -5,-1; 4 -5,1; 5 -3,-1; 6 -3,1; 7 -1,-1; 8 -1,1; 9 1,-1; 10 1,1; 11 3,-1; 12 3,1; 13 5,-1; 14 5,1; 15 7,-1; 16 7,1
87758-2816 = drill 0.9 pad 1.27: 1 -13,-1; 2 -13,1; 3 -11,-1; 4 -11,1; 5 -9,-1; 6 -9,1; 7 -7,-1; 8 -7,1; 9 -5,-1; 10 -5,1; 11 -3,-1; 12 -3,1; 13 -1,-1; 14 -1,1; 15 1,-1; 16 1,1; 17 3,-1; 18 3,1; 19 5,-1; 20 5,1; 21 7,-1; 22 7,1; 23 9,-1; 24 9,1; 25 11,-1; 26 11,1; 27 13,-1; 28 13,1

## Placement (x,y rotation side)
A14_CLKOUT2-  BU-SMB-V  [BU-SMB-V]  126,56 0 top
B14_CLKOUT2+  BU-SMB-V  [BU-SMB-V]  126,69 0 top
C1  4.7nF  [RESC0402_N]  15.9,49.3 180 top
C2  4.7nF  [RESC0402_N]  15.9,50.6 0 top
C3  0.1uF  [RESC0402_N]  21,21 180 top
C4  0.1uF  [RESC0402_N]  25,21 0 top
C5  NFM31PC276B0J3L  [NFM31HK103R1H3L]  135,81 180 top
C6  10uF  [RESC0805_N]  143,82 270 top
C7  0.1uF  [RESC0402_N]  140,82 270 top
C8  10uF  [RESC0805_N]  130,82 270 top
C9  0.1uF  [RESC0402_N]  127,82 270 top
C10  10uF  [RESC0805_N]  21.6,54.9 180 bottom
C11  1uF  [RESC0402_N]  36,50.5 0 bottom
C12  0.1uF  [RESC0402_N]  35.55,49.35 0 bottom
C13  10uF  [RESC0805_N]  20.6,46.5 180 bottom
C14  1uF  [RESC0402_N]  29,51 0 bottom
C15  NFM31PC276B0J3L  [NFM31HK103R1H3L]  135,99 180 top
C16  10uF  [RESC0805_N]  143,100 270 top
C17  0.1uF  [RESC0402_N]  140,100 270 top
C18  10uF  [RESC0805_N]  130,100 270 top
C19  0.1uF  [RESC0402_N]  127,100 270 top
C20  0.1uF  [RESC0402_N]  29,49 0 bottom
C21  10uF  [RESC0805_N]  21.6,52 180 bottom
C22  1uF  [RESC0402_N]  29,53 0 bottom
C23  0.1uF  [RESC0402_N]  26,53 180 bottom
C24  10uF  [RESC0805_N]  20.6,43.35 180 bottom
C25  NFM31PC276B0J3L  [NFM31HK103R1H3L]  135,105 180 top
C26  10uF  [RESC0805_N]  143,106 270 top
C27  0.1uF  [RESC0402_N]  140,106 270 top
C28  10uF  [RESC0805_N]  130,106 270 top
C29  0.1uF  [RESC0402_N]  127,106 270 top
C30  1uF  [RESC0402_N]  31.1,47 90 bottom
C31  0.1uF  [RESC0402_N]  31.1,52.5 270 bottom
C32  1uF  [RESC0402_N]  29,46.6 90 bottom
C33  0.1uF  [RESC0402_N]  26,47 180 bottom
C35  NFM31PC276B0J3L  [NFM31HK103R1H3L]  135,87 180 top
C36  10uF  [RESC0805_N]  143,88 270 top
C37  0.1uF  [RESC0402_N]  140,88 270 top
C38  10uF  [RESC0805_N]  130,88 270 top
C39  0.1uF  [RESC0402_N]  127,88 270 top
C45  NFM31PC276B0J3L  [NFM31HK103R1H3L]  135,93 180 top
C46  10uF  [RESC0805_N]  143,94 270 top
C47  0.1uF  [RESC0402_N]  140,94 270 top
C48  10uF  [RESC0805_N]  130,94 270 top
C49  0.1uF  [RESC0402_N]  127,94 270 top
CLK+  BU-SMB-V  [BU-SMB-V]  10,56 0 top
CLK-  BU-SMB-V  [BU-SMB-V]  10,44 0 top
IC1  ADC12DL2500ACF  [BGA256C100P16X16_1700X1700X331]  32,50 0 top
IC2  SN74AVC4T774PWR  [SOP65P640X120-16N]  23,16 0 top
INA+  BU-SMB-V  [BU-SMB-V]  23,70 0 top
INA-  BU-SMB-V  [BU-SMB-V]  33,70 0 top
INB+  BU-SMB-V  [BU-SMB-V]  23,30 0 top
INB-  BU-SMB-V  [BU-SMB-V]  33,30 0 top
J1  8pin  [1X08]  48,88 90 top
J2  8pin  [1X08]  38,88 90 top
J3  8pin  [1X08]  28,88 90 top
J4  8pin  [1X08]  8,31 270 top
J5  8pin  [1X08]  148,85 90 top
J6  8pin  [1X08]  151.4,55.6 90 top
J7  8pin  [1X08]  8,84 270 top
J8  8pin  [1X08]  103.6,8.5 0 top
J10  8pin  [1X08]  129.6,8.5 0 top
J11  8pin  [1X08]  82.4,100.5 180 top
J12  8pin  [1X08]  140.5,73.4 270 top
J13  8pin  [1X08]  109.4,100.5 180 top
J16  8pin  [1X08]  18,88 90 top
J17  8pin  [1X08]  8,106 270 top
LED1  red  [CHIP-LED0603]  102,2 180 top
LED2  red  [CHIP-LED0603]  105,2 180 top
LED3  red  [CHIP-LED0603]  108,2 180 top
LED4  red  [CHIP-LED0603]  111,2 180 top
LED5  red  [CHIP-LED0603]  114,2 180 top
LED6  red  [CHIP-LED0603]  117,2 180 top
LED7  red  [CHIP-LED0603]  120,2 180 top
LED8  red  [CHIP-LED0603]  123,2 180 top
LED17  red  [CHIP-LED0603]  128,2 180 top
LED18  red  [CHIP-LED0603]  131,2 180 top
LED19  red  [CHIP-LED0603]  134,2 180 top
LED20  red  [CHIP-LED0603]  137,2 180 top
LED21  red  [CHIP-LED0603]  140,2 180 top
LED22  red  [CHIP-LED0603]  143,2 180 top
LED23  red  [CHIP-LED0603]  146,2 180 top
LED24  red  [CHIP-LED0603]  149,2 180 top
LED25  red  [CHIP-LED0603]  84,107 0 top
LED26  red  [CHIP-LED0603]  81,107 0 top
LED27  red  [CHIP-LED0603]  78,107 0 top
LED28  red  [CHIP-LED0603]  75,107 0 top
LED29  red  [CHIP-LED0603]  72,107 0 top
LED30  red  [CHIP-LED0603]  69,107 0 top
LED31  red  [CHIP-LED0603]  66,107 0 top
LED32  red  [CHIP-LED0603]  63,107 0 top
LED33  red  [CHIP-LED0603]  134,75 90 top
LED34  red  [CHIP-LED0603]  134,72 90 top
LED35  red  [CHIP-LED0603]  134,69 90 top
LED36  red  [CHIP-LED0603]  134,66 90 top
LED37  red  [CHIP-LED0603]  134,63 90 top
LED38  red  [CHIP-LED0603]  134,60 90 top
LED39  red  [CHIP-LED0603]  134,57 90 top
LED40  red  [CHIP-LED0603]  134,54 90 top
LED41  red  [CHIP-LED0603]  111,107 0 top
LED42  red  [CHIP-LED0603]  108,107 0 top
LED43  red  [CHIP-LED0603]  105,107 0 top
LED44  red  [CHIP-LED0603]  102,107 0 top
LED45  red  [CHIP-LED0603]  99,107 0 top
LED46  red  [CHIP-LED0603]  96,107 0 top
LED47  red  [CHIP-LED0603]  93,107 0 top
LED48  red  [CHIP-LED0603]  90,107 0 top
PINOUT1  YELLOW-10P-2.54  [H10-2.54]  142,20 90 top
PINOUT2  YELLOW-10P-2.54  [H10-2.54]  142,45.4 270 top
R1  100  [RES-0402]  30,19 0 top
R2  100  [RES-0402]  30,17 0 top
R3  100  [RES-0402]  30,15 0 top
R4  100  [RES-0402]  30,13 0 top
R4_CLKOUT+  BU-SMB-V  [BU-SMB-V]  105,91 0 top
R5  10k  [RES-0402]  30,21 0 top
R6  1k  [RES-0402]  123,5 270 top
R7  1k  [RES-0402]  120,5 270 top
R8  1k  [RES-0402]  117,5 270 top
R9  1k  [RES-0402]  114,5 270 top
R10  1k  [RES-0402]  111,5 270 top
R11  1k  [RES-0402]  108,5 270 top
R12  1k  [RES-0402]  105,5 270 top
R13  1k  [RES-0402]  102,5 270 top
R22  1k  [RES-0402]  149,5 270 top
R23  1k  [RES-0402]  146,5 270 top
R24  1k  [RES-0402]  143,5 270 top
R25  1k  [RES-0402]  140,5 270 top
R26  1k  [RES-0402]  137,5 270 top
R27  1k  [RES-0402]  134,5 270 top
R28  1k  [RES-0402]  131,5 270 top
R29  1k  [RES-0402]  128,5 270 top
R30  1k  [RES-0402]  63,104 90 top
R31  1k  [RES-0402]  66,104 90 top
R32  1k  [RES-0402]  69,104 90 top
R33  1k  [RES-0402]  72,104 90 top
R34  1k  [RES-0402]  75,104 90 top
R35  1k  [RES-0402]  78,104 90 top
R36  1k  [RES-0402]  81,104 90 top
R37  1k  [RES-0402]  84,104 90 top
R38  1k  [RES-0402]  137,54 180 top
R39  1k  [RES-0402]  137,57 180 top
R40  1k  [RES-0402]  137,60 180 top
R41  1k  [RES-0402]  137,63 180 top
R42  1k  [RES-0402]  137,66 180 top
R43  1k  [RES-0402]  137,69 180 top
R44  1k  [RES-0402]  137,72 180 top
R45  1k  [RES-0402]  137,75 180 top
R46  1k  [RES-0402]  90,104 90 top
R47  1k  [RES-0402]  93,104 90 top
R48  1k  [RES-0402]  96,104 90 top
R49  1k  [RES-0402]  99,104 90 top
R50  1k  [RES-0402]  102,104 90 top
R51  1k  [RES-0402]  105,104 90 top
R52  1k  [RES-0402]  108,104 90 top
R53  1k  [RES-0402]  111,104 90 top
T4_CLKOUT-  BU-SMB-V  [BU-SMB-V]  117,91 0 top
X1  87758-1616  [87758-1616]  82,19 0 top
X2  87758-1616  [87758-1616]  98,19 0 top
X13  87758-2816  [87758-2816]  113,59 270 top
X14  87758-2816  [87758-2816]  113,31 270 top
X15  87758-1616  [87758-1616]  87,79 0 top
X16  87758-1616  [87758-1616]  71,79 0 top
X17  87758-2816  [87758-2816]  65,31 270 top
X18  87758-2816  [87758-2816]  65,59 270 top

## Tracks (layer width: path | path; a pad name or v marks a point on that pad's centre or on a via)
3V3  (via drill 0.2)
  top 0.152: J6.6 151.5,68.5 151.5,70.75 J6.7 151.25,71 144.75,71 139,76.75 v133.75,76.75 | X18.2 96.5,72 98.75,74.25 106.25,74.25 v107.75,75.75
  pow2 0.152: v107.75,75.75 108.5,75.75 112,72.25 | v133.75,76.75 131.25,74.25 114,74.25 112,72.25 | 112,72.25 X13.1
5V  (via drill 0.2)
  top 0.152: v81,44.5 106.5,44.5 X13.23 | R45.P$1 139,75 140.5,73.5 J12.1 140.5,72.5 151.25,61.75 151.25,60.75 J6.3 151.5,60.5 151.5,58.25 J6.2 151.25,58 151.25,57.25 150.25,56.25 150.25,44.75 | 150.25,44.75 150.75,45.25 PINOUT2.2 | 150.25,44.75 134,28.5 | 134,28.5 133.25,27.75 133.25,20 PINOUT1.2 | 134,28.5 v121.5,41
  pow2 0.152: X18.24 71.5,44.5 v81,44.5 | X13.23 112.5,50 113.5,49 114.75,49 121.5,42.25 v121.5,41
A5
  top 0.089: X14.11 112.5,34 113.5,33 115.5,33 130.25,18.25 149,18.25 150.75,20 PINOUT1.9
A7  (via drill 0.2)
  top 0.089: v122,18.5 129,18.5 130.25,17.25 149.75,17.25 152,19.5 152,20.5 151.5,21 149.5,21 148.5,20 PINOUT1.8
  pow2 0.089: X2.16 105.75,20 109.25,16.5 120,16.5 v122,18.5
A10  (via drill 0.2)
  top 0.089: v95.5,7.5 96,7.5 101.5,2 124.5,2 127.5,5 140.5,5 141,5.5 141,9 149,17 150.25,17 153.25,20 PINOUT1.10
  pow2 0.089: v95.5,7.5 X1.11
A14_CLKOUT2N
  top 0.152: A14_CLKOUT2-.1 125.1,56.9 122.78,56.9 117.5,62.18 117.5,71.5 114.5,74.5 109.5,74.5 78.89,43.89 78.89,29.25 79,29.14 X1.6
B1
  top 0.089: X14.6 121.25,40 131.75,29.5 131.75,19.25 132.5,18.5 144.25,18.5 145.75,20 PINOUT1.7
B14_CLKOUT2P
  top 0.152: B14_CLKOUT2+.1 121.5,69 115,75.5 108.5,75.5 75,42 X1.2
BG  (via drill 0.2)
  top 0.089: IC1.D2 25,55 25,56.75 24.75,57 24.25,57 18.25,63 v18.25,71.25
  sig2 0.089: v18.25,71.25 9,80.5 9,94.75 8,95.75 J17.5
C2
  top 0.089: X14.3 112.5,42 113.5,41 120.75,41 132,29.75 132,19.5 132.5,19 142.25,19 143.25,20 PINOUT1.6
C6
  pow2 0.089: X2.9 99.75,18 100.75,19 105.75,19 109.25,15.5 136,15.5 140.5,20 PINOUT1.5
C8  (via drill 0.2)
  top 0.089: X1.15 89,18.5 90,19.5 90,20.5 91.25,21.75 104.25,21.75 111.5,29 119,29 130.25,17.75 v136.25,17.75
  pow2 0.089: v136.25,17.75 138,19.5 138,20 PINOUT1.4
CALSTAT  (via drill 0.2)
  top 0.089: R46.P$1 90,102 91.5,100.5 J13.8 | IC1.B1 24.25,56.5 17.75,63 v17.75,72.5
  sig2 0.089: v17.75,72.5 17.75,86.75 9,95.5 9,97 | 9,97 9,97.25 8,98.25 J17.4 | J13.8 83.75,100.5 80.25,97 9,97
CALTRIG  (via drill 0.2)
  top 0.089: IC1.B2 25.5,56.75 25,57.25 v25,63.5
  sig2 0.089: v18.75,70.5 18.75,64.75 20,63.5 v25,63.5
  sig4 0.089: v18.75,70.5 18.75,76 7,87.75 7,102.25 8,103.25 J17.2
CLK_AC_N
  top 0.152: C1.1 17.3,49.3 17.73,49.72 24.28,49.72 IC1.J1
CLK_AC_P
  top 0.152: C2.2 17.3,50.6 17.73,50.18 24.18,50.18 IC1.H1
CLK_N
  top 0.152: C1.2 14.49,49.3 14.07,49.72 12,49.72 10,47.72 CLK-.1
CLK_P
  top 0.152: C2.1 14.49,50.6 14.07,50.18 12,50.18 10,52.18 CLK+.1
D1
  sig2 0.089: X14.4 135.5,20.5 135.5,20 PINOUT1.3
D4
  sig4 0.089: X14.17 112,27.25 113,26.25 113,25.75 113.75,25 114.25,25 133,43.75 133,45.25 PINOUT2.9
D8  (via drill 0.2)
  top 0.089: X1.16 91.25,22.25 98.75,22.25 111.5,35 v125.5,35
  pow2 0.089: v125.5,35 135.75,45.25 PINOUT2.8
D11
  top 0.089: X1.1 75.5,18 76.5,17 85.5,17 86,17.5 86,20.5 88,22.5 94,22.5 111,39.5 111,42.5 111.5,43 128.25,43 130.5,45.25 PINOUT2.10
DIFF1_N  (via drill 0.2)
  top 0.089: IC1.M10 v33.48,46.5
  sig4 0.089: v33.48,46.5 33.88,46.1 34.35,46.1 34.69,46.1 35.31,46.1 35.65,46.1 36.35,46.1 36.69,46.1 37.31,46.1 37.65,46.1 43.1,46.1 43.3,46.3 44,46.3
  sig4 0.152: X14.1 111.5,43.5 74.87,43.5 73.19,41.82 73.19,13.2 71,11 59.5,11 54,16.5 54,45.13 53.32,45.8 47.2,45.8 46.7,46.3 44,46.3
DIFF1_P  (via drill 0.2)
  top 0.089: IC1.M9 v32.52,46.5
  sig4 0.089: v32.52,46.5 33.1,45.92 34.28,45.92 34.76,45.92 35.24,45.92 35.72,45.92 36.28,45.92 36.76,45.92 37.24,45.92 37.72,45.92 43.92,45.92 44,46
  sig4 0.152: X14.2 113.19,43.2 112.51,43.2 112.39,43.07 111.61,43.07 111.49,43.2 75,43.2 73.5,41.7 73.5,13.07 71.22,10.78 | 71.22,10.78 | 71.22,10.78 71.13,10.7 59.37,10.7 59.28,10.78 | 59.28,10.78 | 44,46 46.57,46 47.07,45.5 53.2,45.5 53.7,45 53.7,16.37 59.28,10.78
DIFF2_N  (via drill 0.2)
  top 0.089: IC1.L10 v33.48,47.5
  sig4 0.089: v33.48,47.5 33.88,47.1 34.35,47.1 34.69,47.1 35.31,47.1 35.65,47.1 36.35,47.1 36.69,47.1 37.31,47.1 37.65,47.1 47.3,47.1 47.5,47.3
  sig4 0.152: X13.27 111.5,45.5 74.57,45.5 71.89,42.82 71.89,14.84 71.69,14.65 71.69,14.5 70.19,13 61,13 56.5,17.5 56.5,45.13 54.32,47.3 47.5,47.3
DIFF2_P  (via drill 0.2)
  top 0.089: IC1.L9 v32.52,47.5
  sig4 0.089: v32.52,47.5 33.1,46.92 34.28,46.92 34.76,46.92 35.24,46.92 35.72,46.92 36.28,46.92 36.76,46.92 37.24,46.92 37.72,46.92 47.37,46.92 47.45,47 47.5,47
  sig4 0.152: X13.28 113.19,45.2 112.51,45.2 112.39,45.07 111.61,45.07 111.49,45.2 74.69,45.2 72.13,42.63 72.13,14.74 72,14.61 72,14.37 70.32,12.7 60.87,12.7 56.2,17.37 56.2,45 54.2,47 47.5,47
DIFF3_N  (via drill 0.2)
  top 0.089: IC1.K10 v33.48,48.5
  sig4 0.089: v33.48,48.5 33.88,48.9 36.35,48.9 36.69,48.9 37.31,48.9 37.65,48.9 48.6,48.9 48.84,48.66 49.68,47.82 57,47.82 57.5,47.32 57.5,17.25 61.43,13.32 70.07,13.32 71.68,14.93 71.68,45 73.18,46.5 105.5,46.5 | 105.5,46.5 105.54,46.5 110.49,46.5 110.89,46.9 110.9,46.9 X13.25 | 105.5,46.5
DIFF3_P  (via drill 0.2)
  top 0.089: IC1.K9 v32.52,48.5
  sig4 0.089: v32.52,48.5 33.1,49.08 36.28,49.08 36.76,49.08 37.24,49.08 37.72,49.08 48.67,49.08 48.91,48.84 49.75,48 57.07,48 57.68,47.4 57.68,17.32 61.5,13.5 70,13.5 71.5,15 71.5,45.07 73.1,46.68 105.5,46.68 | X13.26 113.02,48.98 111.59,48.98 110.76,48.15 110.76,47.02 110.42,46.68 105.67,46.68 105.5,46.68 | 105.5,46.68
DIFF4_N  (via drill 0.2)
  top 0.089: IC1.C12 v35.48,55.5
  sig2 0.089: v35.48,55.5 35.88,55.9 36.35,55.9 36.69,55.9 37.31,55.9 37.65,55.9 44.15,55.9 62.13,73.87 104.63,73.87 108.5,70 111.12,70 111.12,70.36 111.64,70.88 112.36,70.88 112.88,70.36 112.88,70 X13.4
DIFF4_P  (via drill 0.2, 0.35)
  top 0.089: IC1.C11 v34.52,55.5
  sig2 0.089: v34.52,55.5 35.1,56.08 36.28,56.08 36.76,56.08 37.24,56.08 37.72,56.08 44.08,56.08 62.05,74.05 104.7,74.05 107.75,71 111.51,71 111.56,71.05 112.44,71.05 112.49,71 115.5,71 v115.5,68.5
  sig4 0.089: v115.5,68.5 116,68 116,28 X14.20
DIFF5_N  (via drill 0.2, 0.35)
  top 0.089: v33.48,49.5 IC1.J10
  sig2 0.089: v49.59,49.14 50.06,49.55 v51.71,52.25
  sig4 0.089: 51.42,52.2 51.97,52.2 51.87,52.25 v51.71,52.25 | v49.59,49.14 49.51,49.02 48.98,49.02 48.5,49.5 v33.48,49.5
  sig4 0.152: X13.21 108,48 72.87,48 70.69,45.82 70.69,16.2 68.5,14 62.5,14 58.13,18.37 58.13,47.58 57.26,48.45 55.17,48.45 51.42,52.2
DIFF5_P  (via drill 0.2, 0.35)
  top 0.089: IC1.J9 v32.52,49.5
  sig2 0.089: 50.95,49.75 v50.7,49.5
  sig2 0.152: v50.31,52.25 50.56,52.5 51.24,52.5 51.5,52.76 51.92,52.76 52.22,52.46 52.22,52.04 52.09,51.91 52.09,51.09 50.95,49.95 50.95,49.75
  sig4 0.089: v32.52,49.5 32.7,49.68 33.09,49.68 33.31,49.9 33.65,49.9 33.87,49.68 49.32,49.68 v50.31,52.25 | 51,49.5 v50.7,49.5
  sig4 0.152: X13.22 112.66,50.66 112.39,50.93 111.61,50.93 111.07,50.39 111.07,49.61 111.34,49.34 109.69,47.7 73,47.7 71,45.7 71,16.07 68.72,13.78 | 68.72,13.78 | 62.28,13.78 | 51,49.5 51.95,50.45 52.74,50.45 54.99,48.21 57.16,48.21 57.89,47.48 57.89,18.18 62.28,13.78 | 68.72,13.78 68.64,13.71 62.36,13.71 62.28,13.78
DIFF6_N  (via drill 0.2)
  top 0.102: IC1.B10 v33.48,56.5
  sig5 0.102: v33.48,56.5 33.11,56.87 33.11,60.61 41.73,69.23 41.73,80.23 48,86.5 120.5,86.5 122,85 122,72.44 121.79,72.23 121.79,70.85 122,70.64 122,67.36 121.79,67.15 121.79,65.77 122,65.56 122,63 119.43,60.43 119.43,60.16 | X13.19 112.99,54.99 114.99,54.99 115.03,55.03 115.03,55.76 119.43,60.16 | 119.43,60.16 | 119.43,60.16
DIFF6_P  (via drill 0.2)
  top 0.102: IC1.B9 v32.52,56.5
  sig5 0.102: v32.52,56.5 32.89,56.87 32.89,60.71 41.5,69.32 41.5,80.32 47.91,86.73 120.59,86.73 122.16,85.16 | 122.16,85.16 | 122.16,85.16 122.23,85.09 122.23,72.34 122.02,72.14 122.02,70.94 122.23,70.74 122.23,67.26 122.02,67.06 122.02,65.86 122.23,65.66 122.23,62.91 122.16,62.84 | 122.16,62.84 | 122.16,62.84 119.66,60.34 | X13.20 114.44,54 115.25,54.81 115.25,55.66 119.66,60.07 119.66,60.34 | 119.66,60.34
DIFF7_N  (via drill 0.2)
  top 0.102: IC1.B12 v35.48,56.5
  sig5 0.102: v35.48,56.5 35.11,56.87 35.11,61.11 43,69 | 43,69 | 43,69 43.07,69.07 43.07,79.76 43,79.82 | 43,79.82 | 43,79.82 42.66,80.16 48.5,86 120,86 121,85 121,64 116.77,59.77 116.77,58.31 115.6,57.14 114.95,57.14 114.83,57.01 113.01,57.01 X13.17
DIFF7_P  (via drill 0.2)
  top 0.102: IC1.B11 v34.52,56.5
  sig5 0.102: v34.52,56.5 34.89,56.87 34.89,61.21 42.84,69.16 42.84,79.66 42.5,80 | 42.5,80 | 42.5,80 42.43,80.07 42.43,80.26 42.5,80.32 | 42.5,80.32 | 42.5,80.32 48.34,86.16 | 48.34,86.16 | 48.34,86.16 48.41,86.23 120.09,86.23 120.16,86.16 | 120.16,86.16 | 120.16,86.16 121.16,85.16 | 121.16,85.16 | 121.16,85.16 121.23,85.09 121.23,63.91 121.16,63.84 | 121.16,63.84 | X13.18 114.28,56 115.19,56.91 115.69,56.91 117,58.22 117,59.68 121.16,63.84
DIFF8_N  (via drill 0.2)
  top 0.102: IC1.B14 v37.48,56.5
  sig5 0.102: X13.15 113.3,59.3 113.59,59.01 114.41,59.01 114.99,59.59 114.99,60.41 114.7,60.7 115.23,61.23 117.5,61.23 120,63.73 120,84.5 119.5,85 49.5,85 44.5,80 44.5,68 44.59,68 44.73,67.87 44.73,67.63 43.59,66.5 42,66.5 37.11,61.61 37.11,56.87 v37.48,56.5
DIFF8_P  (via drill 0.2)
  top 0.102: IC1.B13 v36.52,56.5
  sig5 0.102: X13.16 117,61 117.59,61 120.23,63.63 120.23,84.59 119.66,85.16 | 119.66,85.16 | 119.66,85.16 119.59,85.23 49.41,85.23 49.34,85.16 | 49.34,85.16 | 49.34,85.16 44.27,80.09 44.27,67.91 44.41,67.77 44.5,67.77 44.5,67.73 43.5,66.73 41.91,66.73 36.89,61.71 36.89,56.87 v36.52,56.5
DIFF9_N  (via drill 0.2)
  top 0.102: IC1.C14 v37.48,55.5
  sig5 0.102: X13.10 115.08,64 115.31,64.23 116.89,64.23 117.75,65.09 117.75,65.25 119,66.5 119,83.5 118,84.5 50.5,84.5 45.73,79.73 45.73,66.13 45.09,65.5 42.73,65.5 38.73,61.5 38.73,56.13 38.09,55.5 v37.48,55.5
DIFF9_P  (via drill 0.2)
  top 0.102: IC1.C13 v36.52,55.5
  sig5 0.102: v36.52,55.5 36.75,55.73 37.13,55.73 37.31,55.91 37.65,55.91 37.83,55.73 38,55.73 38.5,56.23 38.5,61.59 42.63,65.73 45,65.73 45.5,66.23 45.5,79.82 50.41,84.73 118.09,84.73 119.16,83.66 | 119.16,83.66 | 119.16,83.66 119.23,83.59 119.23,66.41 119.16,66.34 | 119.16,66.34 | 119.16,66.34 118.16,65.34 118.16,65.18 116.98,64 115.47,64 114.48,63.01 112.99,63.01 X13.9
DIFF10_N  (via drill 0.2)
  top 0.102: IC1.F14 v37.48,52.5 | v82.5,81.5 83.3,80.7 83.59,80.99 84.41,80.99 84.99,80.41 84.99,79.59 84.7,79.3 X15.7
  sig5 0.102: v37.48,52.5 38.82,52.5 42.73,56.41 42.73,61 43.73,62 46.82,62 51.23,66.41 51.23,79.23 54.5,82.5 81.5,82.5 v82.5,81.5
DIFF10_P  (via drill 0.2)
  top 0.102: IC1.F13 v36.52,52.5
  sig5 0.102: v36.52,52.5 36.75,52.73 37.13,52.73 37.31,52.91 37.65,52.91 37.83,52.73 38.73,52.73 42.5,56.5 42.5,61.09 43.63,62.23 46.73,62.23 51,66.5 51,79.32 54.41,82.73 84.59,82.73 84.73,82.59 84.73,80.73 X15.6
DIFF11_N  (via drill 0.2)
  top 0.089: IC1.C10 33.48,55.52 v33.48,55.54
  sig2 0.089: v33.48,55.54 33.48,55.92 33.72,55.92 34.06,56.26 34.06,56.5 34.12,56.56 34.12,56.67 34.35,56.9 34.46,56.9 34.68,57.12 34.68,59.73 34.74,59.8
  sig2 0.152: X13.8 114.5,65.5 118,65.5 121,68.5 121,85 119.03,86.97 118.92,86.97 118.9,87 115.1,87 115.08,86.97 113.84,86.97 113.82,87 108.18,87 108.16,86.97 106.92,86.97 106.9,87 103.1,87 103.08,86.97 101.84,86.97 101.82,87 48.83,87 48.54,86.7 48.2,86.7 37.5,76 37.5,63.93 34.74,61.17 34.74,59.8
DIFF11_P  (via drill 0.2)
  top 0.089: IC1.C9 32.52,55.52 v32.52,55.54
  sig2 0.089: v32.52,55.54 33.2,56.22 33.31,56.1 33.65,56.1 33.88,56.33 33.88,56.63 33.94,56.69 33.94,56.74 34.28,57.08 34.33,57.08 34.5,57.25 34.5,59.61 34.44,59.67
  sig2 0.152: X13.7 112.81,65.19 113.49,65.19 113.61,65.07 114.39,65.07 114.51,65.19 118.13,65.19 121.22,68.28 | 121.22,68.28 | 121.22,68.28 121.31,68.37 121.31,85.13 121.22,85.22 | 121.22,85.22 | 34.44,59.67 34.44,61.3 37.2,64.06 37.2,76.13 48.08,87.01 48.41,87.01 48.71,87.31 101.94,87.31 101.97,87.28 102.95,87.28 102.98,87.31 107.02,87.31 107.05,87.28 108.03,87.28 108.06,87.31 113.94,87.31 113.97,87.28 114.95,87.28 114.98,87.31 119.02,87.31 119.05,87.28 119.15,87.28 121.22,85.22
DIFF12_N  (via drill 0.2)
  top 0.089: IC1.E10 v33.48,53.5
  sig4 0.089: v33.48,53.5 33.88,53.9 34.35,53.9 34.69,53.9 35.31,53.9 35.65,53.9 36.35,53.9 36.69,53.9 37.31,53.9 37.65,53.9 43.83,53.9 44.22,54.28
  sig4 0.152: X15.11 90,79.07 90.39,79.07 90.93,79.61 90.93,80.39 90.39,80.93 90,80.93 90,81.31 91.69,83 91.69,83.81 90.5,85 51,85 46,80 46,56.07 44.22,54.28
DIFF12_P  (via drill 0.2)
  top 0.089: IC1.E9 v32.52,53.5
  sig4 0.089: v32.52,53.5 33.1,54.08 34.28,54.08 34.76,54.08 35.24,54.08 35.72,54.08 36.28,54.08 36.76,54.08 37.24,54.08 37.72,54.08 43.58,54.08 44,54.5
  sig4 0.152: 90.72,85.22 92,83.93 X15.14 | 90.72,85.22 | 90.72,85.22 90.63,85.31 50.87,85.31 50.78,85.22 | 50.78,85.22 | 44,54.5 45.7,56.2 45.7,80.13 50.78,85.22
DIFF13_N  (via drill 0.2)
  top 0.102: IC1.G14 v37.48,51.5
  sig5 0.102: v37.48,51.5 40.09,51.5 43.73,55.13 43.73,57.23 53.23,66.73 53.23,80.23 55,82 76,82 76.57,81.43 80.45,81.43 80.45,81.4 80.42,81.36 79.97,81.36 79.01,80.41 79.01,79.59 79.6,79 81,79 X15.3
DIFF13_P  (via drill 0.2)
  top 0.102: IC1.G13 v36.52,51.5
  sig5 0.102: v36.52,51.5 36.75,51.73 37.13,51.73 37.31,51.91 37.65,51.91 37.83,51.73 40,51.73 43.5,55.23 43.5,57.32 53,66.82 53,80.32 54.84,82.16 | 54.84,82.16 | 54.84,82.16 54.91,82.23 76.09,82.23 76.16,82.16 | 76.16,82.16 | 76.16,82.16 76.66,81.66 76.73,81.67 76.73,81.66 80.55,81.66 80.75,81.46 80.75,80.75 X15.2
DIFF14_N  (via drill 0.2)
  top 0.102: IC1.K14 v37.48,48.5
  sig5 0.089: X15.1 79,78 78.98,78.02 78.98,78.41 78.41,78.98 78.02,78.98 77.98,79.02 77.59,79.02 77.02,79.59 77.02,79.98 76.98,80.02 76.98,80.41 76.41,80.98 76.02,80.98 75.5,81.5
  sig5 0.102: v37.48,48.5 38.48,49.5 40.09,49.5 45.23,54.63 45.23,57.23 55.73,67.73 55.73,81 56.23,81.5 75.5,81.5
DIFF14_P  (via drill 0.2)
  top 0.102: IC1.K13 v36.52,48.5
  sig5 0.089: 75.5,81.73 75.61,81.73 76.14,81.2 76.8,81.2 X16.16
  sig5 0.102: v36.52,48.5 37.75,49.73 40,49.73 45,54.73 45,57.32 55.5,67.82 55.5,81.09 56.13,81.73 75.5,81.73
DIFF15_N
  top 0.102: IC1.A14 37.11,57.89 37.11,58.5 52.61,74 74.3,74 77.03,76.72 77.03,77.03 X16.15
DIFF15_P
  top 0.102: IC1.A13 36.89,57.89 36.89,58.59 52.52,74.23 74.21,74.23 76.59,76.62 76.59,77.2 76.99,77.59 76.99,79.01 X16.14
DIFF16_N  (via drill 0.2)
  top 0.102: IC1.D14 v37.48,54.5
  sig5 0.102: X15.13 91.01,77.01 89.59,77.01 88.99,77.61 88.99,80.41 88.09,81.31 88.04,81.31 87.5,81.85 87.5,84 52,84 47.73,79.73 47.73,66.41 45.32,64 42.73,64 40.23,61.5 40.23,56.13 38.59,54.5 v37.48,54.5
DIFF16_P  (via drill 0.2)
  top 0.102: IC1.D13 v36.52,54.5
  sig5 0.102: v36.52,54.5 36.75,54.73 37.13,54.73 37.31,54.91 37.65,54.91 37.83,54.73 38.5,54.73 40,56.23 40,61.59 42.63,64.23 45.23,64.23 47.5,66.5 47.5,79.82 51.91,84.23 87.59,84.23 87.73,84.09 87.73,81.94 88,81.68 88.32,81.68 X15.12
DIFF17_N  (via drill 0.2)
  top 0.089: IC1.D10 v33.48,54.5
  sig4 0.089: v33.48,54.5 33.88,54.9 34.35,54.9 34.69,54.9 35.31,54.9 35.65,54.9 36.35,54.9 36.69,54.9 37.31,54.9 37.65,54.9 42.35,54.9 42.4,54.85 42.4,54.8
  sig4 0.152: X13.6 112.93,68 112.93,68.39 112.39,68.93 111.61,68.93 111.19,68.51 110,69.69 109.87,69.69 103.19,76.37 103.19,86 49.5,86 42.5,79 42.5,59 44.3,57.2 44.3,56.3 42.9,54.9 42.83,54.9 42.7,54.77 42.43,54.77 42.4,54.8
DIFF17_P  (via drill 0.2)
  top 0.089: IC1.D9 v32.52,54.5
  sig4 0.089: v32.52,54.5 33.1,55.08 34.28,55.08 34.76,55.08 35.24,55.08 35.72,55.08 36.28,55.08 36.76,55.08 37.24,55.08 37.72,55.08 42.35,55.08 42.35,55.17
  sig4 0.152: X13.3 110,70 103.5,76.5 103.5,86.13 103.32,86.31 49.37,86.31 42.2,79.13 42.2,58.87 44,57.07 44,56.5 42.58,55.08 42.56,55.08 42.46,55.17 42.35,55.17
DIFF18_N
  top 0.102: IC1.A12 35.11,57.89 35.11,59.11 51.5,75.5 73.32,75.5 74.16,76.34 74.34,76.34 X16.13
DIFF18_P
  top 0.102: IC1.A11 34.89,57.89 34.89,59.21 51.41,75.73 73.23,75.73 74.99,77.49 74.99,79.01 X16.12
DIFF19_N
  top 0.102: IC1.A10 33.11,57.89 33.11,60.61 49,76.5 70.32,76.5 71.16,77.34 71.49,77.01 73.01,77.01 X16.11
DIFF19_P
  top 0.102: IC1.A9 32.89,57.89 32.89,60.71 48.91,76.73 70.23,76.73 71,77.5 71,79 X16.10
DIFF20_N  (via drill 0.2)
  top 0.102: IC1.E14 v37.48,53.5
  sig5 0.102: X15.9 86.99,79.01 86.99,80.88 86.86,81.02 86.86,81.56 85.62,82.81 85.62,83 52.73,83 49.23,79.5 49.23,65.63 46.59,63 43.23,63 41.23,61 41.23,55.91 38.82,53.5 v37.48,53.5
DIFF20_P  (via drill 0.2)
  top 0.102: IC1.E13 v36.52,53.5
  sig5 0.102: v36.52,53.5 36.75,53.73 37.13,53.73 37.31,53.91 37.65,53.91 37.83,53.73 38.73,53.73 41,56 41,61.09 43.13,63.23 46.5,63.23 49,65.73 49,79.59 52.63,83.23 85.23,83.23 85.57,83.57 85.76,83.57 85.89,83.43 85.89,82.89 85.88,82.88 85.88,82.86 87.09,81.66 87.09,81.25 88,80.33 X15.10
DIFF21_N  (via drill 0.2)
  top 0.089: IC1.F10 v33.48,52.5
  sig4 0.089: v33.48,52.5 33.88,52.9 34.35,52.9 34.69,52.9 35.31,52.9 35.65,52.9 36.35,52.9 36.69,52.9 37.31,52.9 37.65,52.9 44.15,52.9 44.45,53.2 44.5,53.2
  sig4 0.152: X16.5 68,79.07 68.39,79.07 68.93,79.61 68.93,80.39 68.39,80.93 68,80.93 68,83.5 67.5,84 52,84 47.5,79.5 47.5,55.57 45.13,53.2 44.5,53.2
DIFF21_P  (via drill 0.2)
  top 0.089: IC1.F9 v32.52,52.5
  sig4 0.089: v32.52,52.5 33.1,53.08 34.28,53.08 34.76,53.08 35.24,53.08 35.72,53.08 36.28,53.08 36.76,53.08 37.24,53.08 37.72,53.08 44.08,53.08 44.5,53.5
  sig4 0.152: X15.8 81.78,84.22 67.72,84.22 67.63,84.31 51.87,84.31 47.2,79.63 47.2,55.7 45,53.5 44.5,53.5
DIFF22_N  (via drill 0.2)
  top 0.102: IC1.L14 v37.48,47.5
  sig5 0.089: 67,81 68.39,81 68.98,80.41 68.98,79.63 69.63,78.98 71.02,78.98 X16.9
  sig5 0.102: 67,81 62.5,81 56.19,74.69 56.19,67.54 46.23,57.58 46.23,54.41 39.32,47.5 v37.48,47.5
DIFF22_P  (via drill 0.2)
  top 0.102: IC1.L13 v36.52,47.5
  sig5 0.089: 67,81.23 68.77,81.23 X16.8
  sig5 0.102: v36.52,47.5 36.75,47.73 37.13,47.73 37.31,47.91 37.65,47.91 37.83,47.73 39.23,47.73 46,54.5 46,57.68 55.96,67.63 55.96,74.78 62.41,81.23 67,81.23
DIFF23_N  (via drill 0.2)
  top 0.102: IC1.M14 v37.48,46.5
  sig5 0.102: X16.7 67.73,75.73 66.96,75.73 66.73,75.5 58.23,75.5 58.23,68.23 47.73,57.73 47.73,53.13 41.09,46.5 v37.48,46.5
DIFF23_P  (via drill 0.2)
  top 0.102: IC1.M13 v36.52,46.5
  sig5 0.102: v36.52,46.5 36.75,46.73 37.13,46.73 37.31,46.91 37.65,46.91 37.83,46.73 41,46.73 47.5,53.23 47.5,57.82 58,68.32 58,75.59 58.13,75.73 66.64,75.73 66.64,75.84 66.53,75.95 64.66,75.95 63.01,77.59 63.01,79.01 X16.2
DIFF24_N
  top 0.102: IC1.B16 50.41,56.5 62.91,69 65,69 X18.4
DIFF24_P
  top 0.102: IC1.B15 38.94,56.94 40.18,56.94 40.4,56.73 50.31,56.73 63.58,70 X18.3
DIFF25_N  (via drill 0.2, 0.35)
  top 0.102: IC1.P14 v37.48,44.5
  sig4 0.089: v60.22,39.72 60.22,41.72 63.63,45.13 63.64,45.12 64.36,45.12 64.88,45.64 64.88,46 X18.28
  sig5 0.089: 60,40.5 60.22,40.28 v60.22,39.72
  sig5 0.102: 60,40.5 56,44.5 v37.48,44.5
DIFF25_P  (via drill 0.2, 0.35)
  top 0.102: IC1.P13 v36.52,44.5
  sig4 0.089: v61,40.5 62.5,39 62.5,32.5 63.12,31.88 63.12,31.64 63.64,31.12 63.88,31.12 64.12,30.88 64.36,30.88 64.88,30.36 64.88,30.12 65,30 X17.16
  sig5 0.089: 60.16,40.66 60.32,40.5 v61,40.5
  sig5 0.102: v36.52,44.5 36.75,44.73 37.13,44.73 37.31,44.91 37.65,44.91 37.83,44.73 56.09,44.73 60.16,40.66
DIFF26_N
  top 0.102: X18.6 65.27,67.27 64.67,67.27 64.41,67.01 63.59,67.01 63.33,67.27 62.5,67.27 51,55.77 51,55.41 50.87,55.27 40.13,55.27 39.91,55.5 IC1.C16
DIFF26_P
  top 0.102: X18.5 63.5,67.5 62.41,67.5 50.77,55.87 50.77,55.5 40.24,55.5 39.79,55.94 38.94,55.94 IC1.C15
DIFF27_N  (via drill 0.2)
  top 0.089: IC1.D12 v35.48,54.5
  sig2 0.089: v35.48,54.5 35.88,54.9 36.35,54.9 36.69,54.9 37.31,54.9 37.65,54.9 41.5,54.9 41.5,54.87
  sig2 0.152: X18.10 64.93,64 64.93,63.61 64.39,63.07 63.61,63.07 63.09,63.59 54.7,55.2 41.8,55.2 41.71,55.11 41.71,54.99 41.59,54.87 41.5,54.87
DIFF27_P  (via drill 0.2)
  top 0.089: IC1.D11 v34.52,54.5
  sig2 0.089: v34.52,54.5 35.1,55.08 36.28,55.08 36.76,55.08 37.24,55.08 37.72,55.08 41.5,55.08 41.47,55.11
  sig2 0.152: X18.8 65.07,66 64.93,65.86 64.93,65.61 64.39,65.07 64.14,65.07 64,64.93 63.61,64.93 63.07,64.39 63.07,64 54.57,55.5 41.92,55.5 41.86,55.44 41.7,55.44 41.47,55.21 41.47,55.11
DIFF28_N
  top 0.102: IC1.J16 40,49 47.4,49 59.48,36.92 63.08,36.92 X17.9
DIFF28_P
  top 0.102: IC1.J15 39.19,48.81 39.32,48.94 39.68,48.94 39.85,48.77 47.31,48.77 59.39,36.69 62.42,36.69 62.67,36.44 62.67,35.93 63.59,35.01 64.41,35.01 65,35.6 65,41 X17.4
DIFF29_N  (via drill 0.2, 0.35)
  top 0.102: IC1.N14 v37.48,45.5
  sig4 0.089: v62.48,71 63.12,71.65 63.12,72.36 63.64,72.88 64,72.88 X16.1
  sig5 0.089: 52.5,61 62.18,70.68 62.18,71 v62.48,71
  sig5 0.102: 52.5,61 49.73,58.23 49.73,53.91 41.32,45.5 v37.48,45.5
DIFF29_P  (via drill 0.2, 0.35)
  top 0.102: IC1.N13 v36.52,45.5
  sig4 0.089: v61.37,71 63.37,73 63.44,72.93 62.95,72.44 62.95,71.72 62.69,71.46 62.67,71.48 62.28,71.48 62,71.2 62,70.8 62.28,70.52 62.67,70.52 62.95,70.8 62.95,71.2 62.94,71.21 63.24,71.52 63.64,71.12 64.36,71.12 64.88,71.64 64.88,72.36 64.36,72.88 64.18,72.88 64.18,73 67.5,73 68,72.5 68,46 X17.2
  sig5 0.089: 52.34,61.16 62,70.82 62,71 v61.37,71
  sig5 0.102: v36.52,45.5 36.75,45.73 37.13,45.73 37.31,45.91 37.65,45.91 37.83,45.73 41.23,45.73 49.5,54 49.5,58.32 52.34,61.16
DIFF30_N
  top 0.102: X18.11 62.3,63.7 60.2,63.7 50.77,54.27 49.96,54.27 49.95,54.26 39.74,54.26 IC1.D16
DIFF30_P
  top 0.102: X18.9 60.18,64 50.68,54.5 49.8,54.5 49.79,54.49 40.31,54.49 39.86,54.94 38.94,54.94 IC1.D15
DIFF31_N
  top 0.102: X18.13 58,60 51.43,53.43 50.79,53.43 | IC1.E16 40.2,53.5 40.26,53.43 50.79,53.43 | 50.79,53.43
DIFF31_P
  top 0.102: X18.14 65.77,60.23 64.99,60.23 64.99,60.41 64.41,60.99 63.59,60.99 63.01,60.41 63.01,60.23 57.91,60.23 51.34,53.66 | IC1.E15 38.94,53.94 40.15,53.94 40.43,53.66 51.34,53.66 | 51.34,53.66
DIFF32_N  (via drill 0.2)
  top 0.089: IC1.G10 v33.48,51.5
  sig4 0.089: v33.48,51.5 33.88,51.9 36.35,51.9 36.69,51.9 37.31,51.9 37.65,51.9 44.15,51.9 44.45,52.2 44.5,52.2
  sig4 0.152: X18.15 63.5,58.5 53.5,58.5 47.2,52.2 44.5,52.2
DIFF32_P  (via drill 0.2)
  top 0.089: IC1.G9 v32.52,51.5
  sig4 0.089: v32.52,51.5 33.1,52.08 36.28,52.08 36.76,52.08 37.24,52.08 37.72,52.08 44.08,52.08 44.5,52.5
  sig4 0.152: X18.16 65.19,58.8 64.51,58.8 64.39,58.93 63.61,58.93 63.49,58.8 53.37,58.8 47.07,52.5 44.5,52.5
DIFF33_N  (via drill 0.2)
  top 0.089: IC1.H10 v33.48,50.5
  sig4 0.089: v33.48,50.5 33.88,50.9 42.37,50.9 42.67,51.2 44.5,51.2
  sig4 0.152: X18.17 63.5,56.5 53.5,56.5 48.2,51.2 44.5,51.2
DIFF33_P  (via drill 0.2)
  top 0.089: IC1.H9 v32.52,50.5
  sig4 0.089: v32.52,50.5 33.1,51.08 42.3,51.08 42.72,51.5 44.5,51.5
  sig4 0.152: X18.18 65.19,56.8 64.51,56.8 64.39,56.93 63.61,56.93 63.49,56.8 53.37,56.8 48.07,51.5 44.5,51.5
DIFF34_N
  top 0.102: X18.19 63.5,53.5 52.18,53.5 51.84,53.16 51.83,53.17 51.83,53.18 40.34,53.18 40.12,52.95 39.95,52.95 IC1.F16
DIFF34_P
  top 0.102: X18.20 65.27,53.27 64.67,53.27 64.41,53.01 63.59,53.01 63.33,53.27 52.27,53.27 52,53 51.93,52.93 51.62,52.93 51.6,52.95 40.44,52.95 40.3,52.81 40.3,52.67 39.68,52.06 38.94,52.06 IC1.F15
DIFF35_N
  top 0.102: IC1.K16 40,48 46.82,48 61.82,33 62.09,33 62.23,32.87 62.23,32.77 63.01,31.99 63.01,31.59 63.59,31.01 63.99,31.01 64.01,30.99 64.41,30.99 64.99,30.41 64.99,30.01 65.01,29.99 65.01,29.59 65.59,29.01 65.99,29.01 66,29 X17.18
DIFF35_P
  top 0.102: IC1.K15 39.19,47.81 39.32,47.94 39.68,47.94 39.85,47.77 46.73,47.77 61.73,32.77 62,32.77 62,32.68 62.78,31.89 62.78,31.5 63.44,30.84 63.01,30.41 63.01,29.59 63.59,29.01 64.41,29.01 64.84,29.44 65.44,28.84 65.01,28.41 65.01,27.59 65.59,27.01 66.51,27.01 67,27.5 67,33 66.7,33.3 66.41,33.01 65.59,33.01 65.01,33.59 65.01,34 X17.11
DIFF36_N
  top 0.089: IC1.G16 41,51.5
  top 0.102: 41,51.5 61,51.5 61.5,52 | 61.5,52 | 61.5,52 61.57,52.07 61.76,52.07 61.82,52 63.01,52 63.01,51.59 63.59,51.01 64.41,51.01 64.99,51.59 64.99,52 X18.22
DIFF36_P  (via drill 0.2)
  top 0.089: IC1.G15 39.06,51.5 39.06,51.32 39.32,51.06 39.68,51.06 39.94,51.32 40.68,51.32 41,51
  top 0.102: 41,51 60.82,51 61.66,51.84 v61.66,51.6 v61.67,51.59
  sig2 0.102: v61.67,51.59 63.59,51.59 X18.21
DIFF37_N
  top 0.102: IC1.H16 62.15,50.5 62.7,49.96 62.7,49.91 63.6,49 65,49 X18.26
DIFF37_P
  top 0.102: IC1.H15 38.94,50.06 40.19,50.06 40.4,50.27 62.06,50.27 62.32,50 62.32,49.68 X18.25
DIFF38_N
  top 0.102: IC1.L16 40,47 46.59,47 61.73,31.87 61.73,27.33 62.28,26.78 63.22,26.78 X17.19
DIFF38_P
  top 0.102: IC1.L15 39.19,46.81 39.32,46.94 39.68,46.94 39.85,46.77 46.5,46.77 61.5,31.77 61.5,27.24 62.19,26.55 62.36,26.55 62.53,26.38 62.53,26.08 63.59,25.01 64.99,25.01 X17.22
DIFF39_N  (via drill 0.35)
  top 0.089: v55.19,37.31 55,37.31 46.59,45.72 46.59,45.74 46.24,46.09 46.22,46.09 45.88,46.43 43.15,46.43 43.08,46.5 IC1.M16
  sig5 0.089: X17.21 63,24 55.1,31.9 55.1,37.22 v55.19,37.31
DIFF39_P  (via drill 0.35)
  top 0.089: v54.55,36.36 54.57,37.49 46.41,45.65 46.41,45.67 46.17,45.91 46.15,45.91 45.81,46.25 43.08,46.25 43,46.32 39.94,46.32 39.68,46.06 39.32,46.06 39.06,46.32 39.06,46.5 IC1.M15
  sig5 0.089: X17.24 64.98,22 64.98,22.41 64.41,22.98 63.77,22.98 63.73,23.02 63.59,23.02 63.02,23.59 63.02,23.73 54.82,31.93 54.82,36.35 v54.55,36.36
DIFF40_N
  top 0.089: IC1.N16 42.94,45.5 45.68,42.76 45.68,40.82 48.18,38.32 48.18,28.5 | X17.26 64.98,21.02 64.98,22.41 64.37,23.02 53.41,23.02 48.18,28.25 48.18,28.36 48.18,28.5 | 48.18,28.5
DIFF40_P
  top 0.089: IC1.N15 38.68,45.32 39.06,45.32 39.32,45.06 39.68,45.06 39.94,45.32 42.86,45.32 45.5,42.69 45.5,40.75 48,38.25 48,28.18 53.34,22.84 63.16,22.84 X17.23
DIFF41_N  (via drill 0.2)
  top 0.089: IC1.P12 v35.48,44.5
  sig2 0.089: v35.48,44.5 35.88,44.1 36.35,44.1 36.69,44.1 37.31,44.1 37.65,44.1 40.5,44.1 40.5,44
  sig2 0.152: X1.8 80.5,20 80.08,20.41 80.08,20.45 79.45,21.09 79.42,21.09 79,21.5 74,21.5 73.5,21 73.5,17 74,16.5 74,11 73,10 55.5,10 49,16.5 49,43.34 48.1,44.24 41.05,44.24 40.8,44 40.5,44
DIFF41_P  (via drill 0.2)
  top 0.089: IC1.P11 v34.52,44.5
  sig2 0.089: v34.52,44.5 35.1,43.92 36.28,43.92 36.76,43.92 37.24,43.92 37.72,43.92 40.29,43.92 40.29,43.91 40.41,43.79 40.94,43.79 41.07,43.93
  sig2 0.152: X1.5 77.5,16.5 74.5,16.5 74.5,11.16 73.1,9.76 55.4,9.76 48.76,16.4 48.76,43.24 48,44 41.15,44 41.07,43.93
DIFF42_N  (via drill 0.2)
  top 0.089: IC1.N12 v35.48,45.5
  sig2 0.089: v35.48,45.5 35.88,45.1 36.35,45.1 36.69,45.1 37.31,45.1 37.65,45.1 41,45.1 41,45.2
  sig2 0.152: X1.10 81.5,21.5 81.5,22.63 79.82,24.3 74.87,24.3 71.69,21.13 71.69,12.5 71.19,12 57.5,12 54,15.5 54,44.43 53.13,45.3 41.2,45.3 41.09,45.2 41,45.2
DIFF42_P  (via drill 0.2)
  top 0.089: IC1.N11 v34.52,45.5
  sig2 0.089: v34.52,45.5 35.1,44.92 36.28,44.92 36.76,44.92 37.24,44.92 37.72,44.92 41,44.92 41,44.83
  sig2 0.152: X1.7 81,19.07 81.39,19.07 81.93,19.61 81.93,20.39 81.39,20.93 81,20.93 81,22.3 81.19,22.5 79.69,24 75,24 72,21 72,12.37 71.32,11.7 57.37,11.7 53.7,15.37 53.7,44.3 53,45 41.33,45 41.22,44.89 41.18,44.89 41.11,44.83 41,44.83
DIFF43_N  (via drill 0.2)
  top 0.089: IC1.M12 v35.48,46.5
  sig2 0.089: v35.48,46.5 35.88,46.1 36.35,46.1 36.69,46.1 37.31,46.1 37.65,46.1 55.59,46.1 55.7,46
  sig2 0.152: X1.9 83,19.07 83.39,19.07 83.93,19.61 83.93,20.39 83.39,20.93 83,20.93 83,22.8 83.19,23 80.69,25.5 74.5,25.5 71,22 71,14.07 70.72,13.78 | 70.72,13.78 | 70.72,13.78 70.63,13.7 58.37,13.7 58.28,13.78 | 58.28,13.78 | 55.7,46 55.7,16.37 58.28,13.78
DIFF43_P  (via drill 0.2, 0.35)
  top 0.089: IC1.M11 v34.52,46.5
  sig2 0.089: v34.52,46.5 35.1,45.92 36.28,45.92 36.76,45.92 37.24,45.92 37.72,45.92 54.08,45.92 v54.5,45.5 | v55.49,46.99 55.82,46.66 55.82,46.3
  sig2 0.152: X1.12 83.5,21.5 83.5,23.13 80.82,25.8 74.37,25.8 70.69,22.13 70.69,14.2 70.5,14 58.5,14 56,16.5 56,46.13 55.82,46.3
  sig5 0.089: v54.5,45.5 54.5,46 v55.49,46.99
DIFF44_N  (via drill 0.2)
  top 0.089: IC1.F12 v35.48,52.5
  sig2 0.089: v35.48,52.5 35.98,53 36.2,53 36.28,52.92 36.76,52.92 36.84,53 37.16,53 37.24,52.92 37.72,52.92 37.8,53 42,53 42.55,52.45 49.83,52.45 50.11,52.73 50.48,52.73 51.13,53.37 53.13,53.37 58,48.5 58,18.75 60.93,15.82 68.57,15.82 68.68,15.93 68.68,28 71.68,31 79.5,31 v79.5,29.5
  sig4 0.089: X1.3 78.25,19.25 77.95,19.56 77.95,20.44 78.56,21.05 79.5,21.05 v79.5,29.5
DIFF44_P  (via drill 0.2)
  top 0.089: IC1.F11 v34.52,52.5
  sig2 0.089: v34.52,52.5 35.2,53.18 35.23,53.18 35.31,53.1 35.65,53.1 35.73,53.18 36.27,53.18 36.35,53.1 36.69,53.1 36.77,53.18 37.23,53.18 37.31,53.1 37.65,53.1 37.73,53.18 42.07,53.18 42.63,52.63 49.76,52.63 50.04,52.9 50.4,52.9 51.05,53.55 53.2,53.55 58.18,48.57 58.18,18.82 61,16 68.5,16 68.5,28.07 71.6,31.18 79.57,31.18 79.68,31.07 79.68,31 80.46,30.22 v80.46,29.5
  sig4 0.089: v80.46,29.5 81.5,29.5 90.38,20.62 90.64,20.88 91.36,20.88 91.88,20.36 91.88,19.64 91.62,19.38 X2.3
DIFF45_N  (via drill 0.2)
  top 0.089: IC1.E12 v35.48,53.5
  sig2 0.089: v35.48,53.5 35.88,53.9 36.35,53.9 36.69,53.9 37.31,53.9 37.65,53.9 41.35,53.9 41.35,53.87
  sig2 0.152: X17.15 65.34,28.66 65.07,28.39 65.07,27.61 65.61,27.07 66.39,27.07 66.66,27.34 68.22,25.78 68.22,18.22 68.29,18.14 68.29,17.86 68.22,17.78 | 68.22,17.78 | 68.22,17.78 66.72,16.28 | 66.72,16.28 | 61.78,16.28 | 61.78,16.28 59.2,18.87 59.2,48.8 54,54 41.61,54 41.48,53.87 41.35,53.87 | 66.72,16.28 66.64,16.21 61.86,16.21 61.78,16.28
DIFF45_P  (via drill 0.2)
  top 0.089: IC1.E11 v34.52,53.5
  sig2 0.089: v34.52,53.5 35.1,54.08 36.28,54.08 36.76,54.08 37.24,54.08 37.72,54.08 41.35,54.08 41.38,54.11
  sig2 0.152: X17.25 65.07,20 65.07,19.61 65.61,19.07 66.39,19.07 66.66,19.34 68,18 66.5,16.5 62,16.5 59.5,19 59.5,48.93 54.13,54.3 41.58,54.3 41.38,54.11
DIFF46_N
  top 0.089: IC1.P16 39.56,44.44 43.02,44.44 44.18,43.28 44.18,41.32 46.68,38.82 46.68,29 61.18,14.5 83.5,14.5 84.5,15.5 84.55,15.66 84.55,15.77 86.78,18 X1.13
DIFF46_P
  top 0.089: IC1.P15 38.74,44.26 39.12,44.26 39.32,44.06 39.68,44.06 39.88,44.26 42.94,44.26 44,43.21 44,41.25 46.5,38.75 46.5,28.93 61.1,14.32 83.57,14.32 84.63,15.37 84.78,15.5 84.85,15.56 84.85,15.81 85.48,16.44 86.83,16.44 87.98,17.59 87.98,19.02 X1.14
DIFF47_N
  top 0.102: IC1.T14 37.11,42.11 37.11,42 38.11,41 40.59,41 42.23,39.37 42.23,30.27 60,12.5 96.15,12.5 101,17.35 X2.11
DIFF47_P
  top 0.102: IC1.T13 36.89,42.11 36.89,41.91 38.02,40.77 40.5,40.77 42,39.27 42,30.18 59.91,12.27 96.25,12.27 100.66,16.68 101.08,16.68 101.99,17.59 101.99,19.01 X2.12
DIFF48_N
  top 0.102: IC1.T12 35.11,42.11 35.11,41.5 36.61,40 40.32,40 40.73,39.59 40.73,29 59.23,10.5 98,10.5 99,11.5 99,11.88 102.77,15.65 102.77,17.77 X2.13
DIFF48_P
  top 0.102: IC1.T11 34.89,42.11 34.89,41.41 36.52,39.77 40.23,39.77 40.5,39.5 40.5,28.91 59.13,10.27 98.09,10.27 99.31,11.49 99.31,11.87 103,15.56 103,16.72 103.11,16.83 103.23,16.83 103.99,17.59 103.99,19.01 X2.14
DIFF49_N  (via drill 0.2)
  top 0.089: IC1.L12 v35.48,47.5
  sig2 0.089: v35.48,47.5 35.88,47.1 36.35,47.1 36.69,47.1 37.31,47.1 37.65,47.1 41.45,47.1 41.49,47.13
  sig2 0.152: X2.6 94,21 94,22.13 87.82,28.3 75.37,28.3 69.19,22.13 69.19,15.5 59.5,15.5 57.5,17.5 57.5,48.13 57.32,48.3 46.87,48.3 45.57,47 41.61,47 41.61,47.01 41.49,47.13
DIFF49_P  (via drill 0.2)
  top 0.089: IC1.L11 v34.52,47.5
  sig2 0.089: v34.52,47.5 35.1,46.92 36.28,46.92 36.76,46.92 37.24,46.92 37.72,46.92 41.4,46.92 41.38,46.91 41.38,46.88
  sig2 0.152: X2.5 93.69,19.3 93.69,19.38 93.93,19.61 93.93,20.39 93.69,20.62 93.69,22 87.69,28 75.5,28 69.5,22 69.5,15.37 69.32,15.2 59.37,15.2 57.2,17.37 57.2,48 47,48 45.7,46.7 41.63,46.7 41.56,46.76 41.51,46.76 41.38,46.88
DIFF50_N
  top 0.102: IC1.T10 33.11,42.11 33.11,41.39 35.5,39 39.09,39 39.73,38.37 39.73,27 57.73,9 100,9 106.23,15.23 113.83,15.23 115.36,16.75 115.36,18.64 X14.26
DIFF50_P
  top 0.102: IC1.T9 32.89,42.11 32.89,41.29 35.41,38.77 39,38.77 39.5,38.27 39.5,26.91 57.63,8.77 100.09,8.77 106.32,15 113.93,15 115.58,16.66 115.58,20.41 X14.24
DIFF51_N  (via drill 0.2)
  top 0.102: IC1.R12 v35.48,43.5
  sig5 0.102: v35.48,43.5 35.48,43.02 36.5,42 39.32,42 43.73,37.59 43.73,27 59.23,11.5 123,11.5 124.5,13 124.5,26 121.51,28.99 121.5,28.98 121.5,28.96 116.39,28.96 115.31,30.04 115.31,30.09 114.41,30.99 113.01,30.99 X14.13
DIFF51_P  (via drill 0.2)
  top 0.102: IC1.R11 v34.52,43.5
  sig5 0.102: v34.52,43.5 35.18,42.84 35.34,42.84 36.41,41.77 39.23,41.77 43.5,37.5 43.5,26.91 59.13,11.27 123.09,11.27 124.66,12.84 | 124.66,12.84 | 124.66,12.84 124.73,12.9 124.73,26.09 124.66,26.16 | 124.66,26.16 | X14.14 115.68,30.32 115.68,30 116.48,29.19 121.24,29.19 121.28,29.23 121.59,29.23 124.66,26.16
DIFF52_N  (via drill 0.2)
  top 0.089: IC1.P10 v33.48,44.5
  sig2 0.089: v33.48,44.5 33.48,44.08 33.72,44.08 34.06,43.74 34.06,43.5 34.12,43.44 34.12,43.33 34.18,43.27 34.18,41 34.27,41
  sig2 0.152: X14.5 112,39.65 109.5,37.15 109.37,37.15 108.19,35.97 108.19,17 102.69,11.5 79.57,11.5 76.28,8.22 54.78,8.22 44.5,18.5 44.5,37.13 42.82,38.8 35,38.8 34.5,39.3 34.5,40.68 34.3,40.87 34.3,40.92 34.27,40.95 34.27,41
DIFF52_P  (via drill 0.2)
  top 0.089: IC1.P9 v32.52,44.5
  sig2 0.089: v32.52,44.5 33.22,43.8 33.31,43.9 33.65,43.9 33.88,43.67 33.88,43.37 33.94,43.31 33.94,43.26 34,43.2 34,41 33.91,41
  sig2 0.152: X14.12 112.66,35.34 112.93,35.61 112.93,36.39 112.39,36.93 111.61,36.93 111.34,36.66 111.15,36.85 109.5,36.85 108.5,35.85 108.5,16.87 102.82,11.2 79.69,11.2 76.5,8 | 76.5,8 | 76.5,8 76.41,7.91 54.66,7.91 54.57,8 | 54.57,8 | 54.57,8 44.2,18.37 44.2,37 42.7,38.5 34.87,38.5 34.2,39.18 34.2,39.5 34,39.7 34,40.79 33.91,40.89 33.91,41
DIFF53_N  (via drill 0.2)
  top 0.089: IC1.N10 v33.48,45.5
  sig4 0.089: v33.48,45.5 33.88,45.1 34.35,45.1 34.69,45.1 35.31,45.1 35.65,45.1 36.35,45.1 36.69,45.1 37.31,45.1 37.65,45.1 48.15,45.1 52.68,40.57 52.68,14 57.68,9 88,9 94.68,15.68 107,15.68 109,17.68 109,33.07 109.1,33.18 109.12,33.18 109.22,33.25 109.41,33.43 109.43,33.43 110.88,34.88 | 110.88,34.88 X14.9 | 110.88,34.88
DIFF53_P  (via drill 0.2)
  top 0.089: IC1.N9 v32.52,45.5
  sig4 0.089: v32.52,45.5 33.1,44.92 34.28,44.92 34.76,44.92 35.24,44.92 35.72,44.92 36.28,44.92 36.76,44.92 37.24,44.92 37.72,44.92 48.08,44.92 52.5,40.5 52.5,13.93 57.6,8.82 88.07,8.82 94.75,15.5 107.07,15.5 109.18,17.6 109.18,33 109.26,33.06 109.31,33.06 111.25,35 113,35 X14.10
DIFF54_N
  top 0.089: IC1.R16 39.57,43.43 43.04,43.43 | 43.04,43.43 | 43.04,43.43 43.11,43.43 43.21,43.33 43.21,41.29 45.68,38.82 45.68,28.82 61,13.5 94,13.5 95,14.5 95.1,14.66 95.1,14.71 97.98,17.59 97.98,18.98 X2.10
DIFF54_P
  top 0.089: IC1.R15 38.74,43.26 39.13,43.26 39.32,43.06 39.68,43.06 39.87,43.26 43.04,43.26 43.04,41.21 45.5,38.75 45.5,28.75 60.93,13.32 94.07,13.32 95.13,14.37 95.28,14.46 95.52,14.7 95.52,14.88 97.53,16.89 99.28,16.89 99.98,17.59 99.98,20.41 99.41,20.98 97.98,20.98 X2.8
DIFF55_N  (via drill 0.2)
  top 0.102: IC1.R10 v33.48,43.5
  sig5 0.102: v33.48,43.5 33.11,43.13 33.11,43 35.11,41 37.82,41 42.23,36.59 42.23,24.5 56.73,10 124.5,10 126,11.5 126,29.36 117.59,37.77 115.75,37.77 114.99,37.01 112.99,37.01 X14.7
DIFF55_P  (via drill 0.2)
  top 0.102: IC1.R9 v32.52,43.5
  sig5 0.102: v32.52,43.5 32.89,43.13 32.89,42.91 35.02,40.77 37.73,40.77 42,36.5 42,24.41 56.63,9.77 124.59,9.77 126.23,11.4 126.23,29.45 117.68,38 X14.8
DIFF56_N  (via drill 0.2)
  top 0.102: IC1.R14 v37.48,43.5
  sig5 0.102: v37.48,43.5 37.98,43 40.59,43 45.23,38.37 45.23,28.27 60,13.5 121,13.5 122.5,15 122.5,24 118.5,28 117.96,28 | 115.31,28 X14.18 | 115.31,28 | 117.96,28 115.31,28 | 117.96,28
DIFF56_P  (via drill 0.2)
  top 0.102: IC1.R13 v36.52,43.5
  sig5 0.102: v36.52,43.5 37.25,42.77 40.5,42.77 45,38.27 45,28.18 59.84,13.34 | 59.84,13.34 | 59.84,13.34 59.91,13.27 121.09,13.27 121.16,13.34 | 121.16,13.34 | 121.16,13.34 122.66,14.84 | 122.66,14.84 | 122.66,14.84 122.73,14.9 122.73,24.09 122.66,24.16 | 122.66,24.16 | X14.15 113,29 114.7,29 115.47,28.23 118.59,28.23 122.66,24.16
E5
  sig4 0.089: X14.25 112.75,20 113.75,21 116.25,21 140.5,45.25 PINOUT2.6
E6  (via drill 0.2)
  top 0.089: X2.15 110.5,18 111.5,19 v113.25,19
  sig4 0.089: v113.25,19 116.5,19 130.5,33 131,33 143.25,45.25 PINOUT2.5
E7  (via drill 0.2)
  top 0.089: v115.25,41.5 133.25,41.5 137,45.25 137,45.75 137.75,46.5 144.75,46.5 145.75,45.5 PINOUT2.4
  sig4 0.089: X2.7 97,18.75 98,19.75 98,27.25 111.75,41 114.75,41 v115.25,41.5
E9  (via drill 0.2)
  top 0.089: v93.5,23.25 93.5,27 111.5,45 128.75,45 130.5,46.75 147,46.75 PINOUT2.3
  pow2 0.089: X2.2 91,20.75 v93.5,23.25
E10  (via drill 0.2)
  top 0.089: v84.25,19 84.25,19.25 84,19.5 84,20.5 110.5,47 129.75,47 130.25,47.5 147.75,47.5 149.5,45.75 149.5,45 148.75,44.25 139.25,44.25 138.25,45.25 PINOUT2.7
  pow2 0.089: X2.1 90.25,18 89.25,19 v84.25,19
E11_SYNCSE  (via drill 0.2)
  top 0.089: v44.5,37.75 40.5,41.75 38.5,41.75 38,42.25 38,53.75 37.75,54 26,54 IC1.E2 25.5,53.88 25.94,54.32 25.94,58.09 25.5,58.52 v25.5,64.5
  pow2 0.089: X1.4 77,20.25 66.25,31 51.25,31 v44.5,37.75